# EAGLE board bfc (EAGLE 9.6.1), part 1 of 3
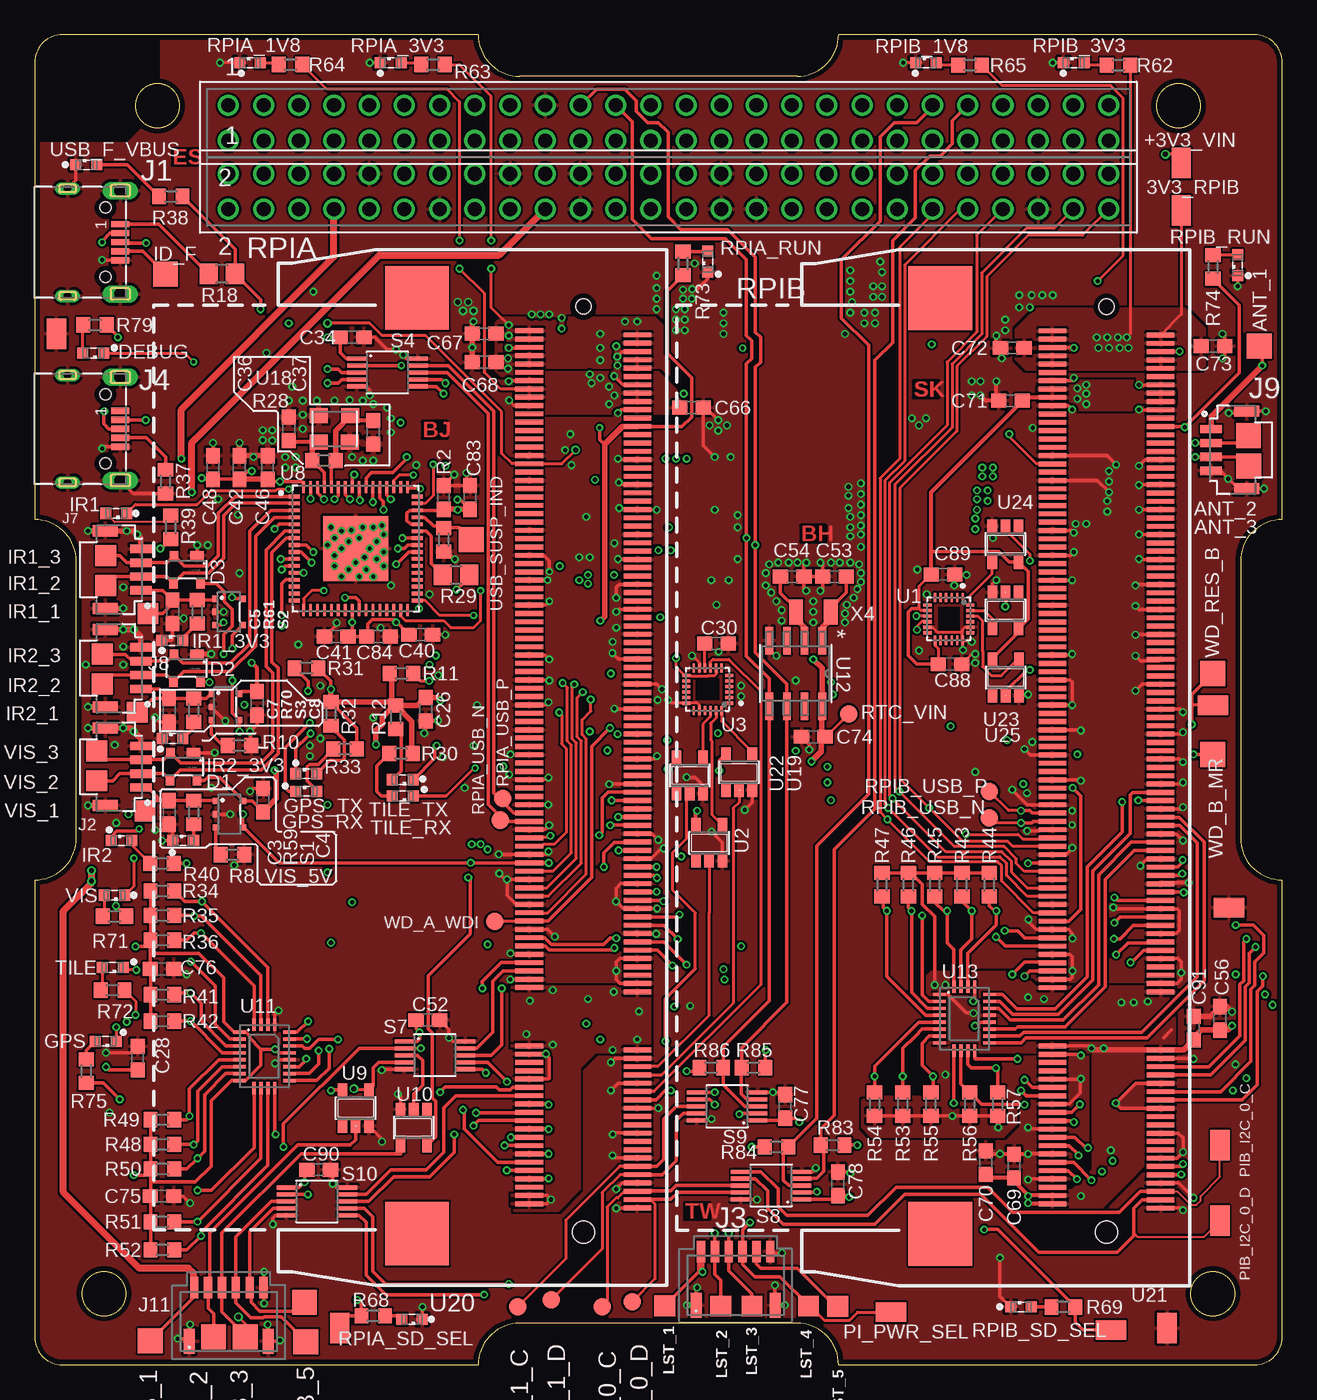
[diagram p8: board, top side]
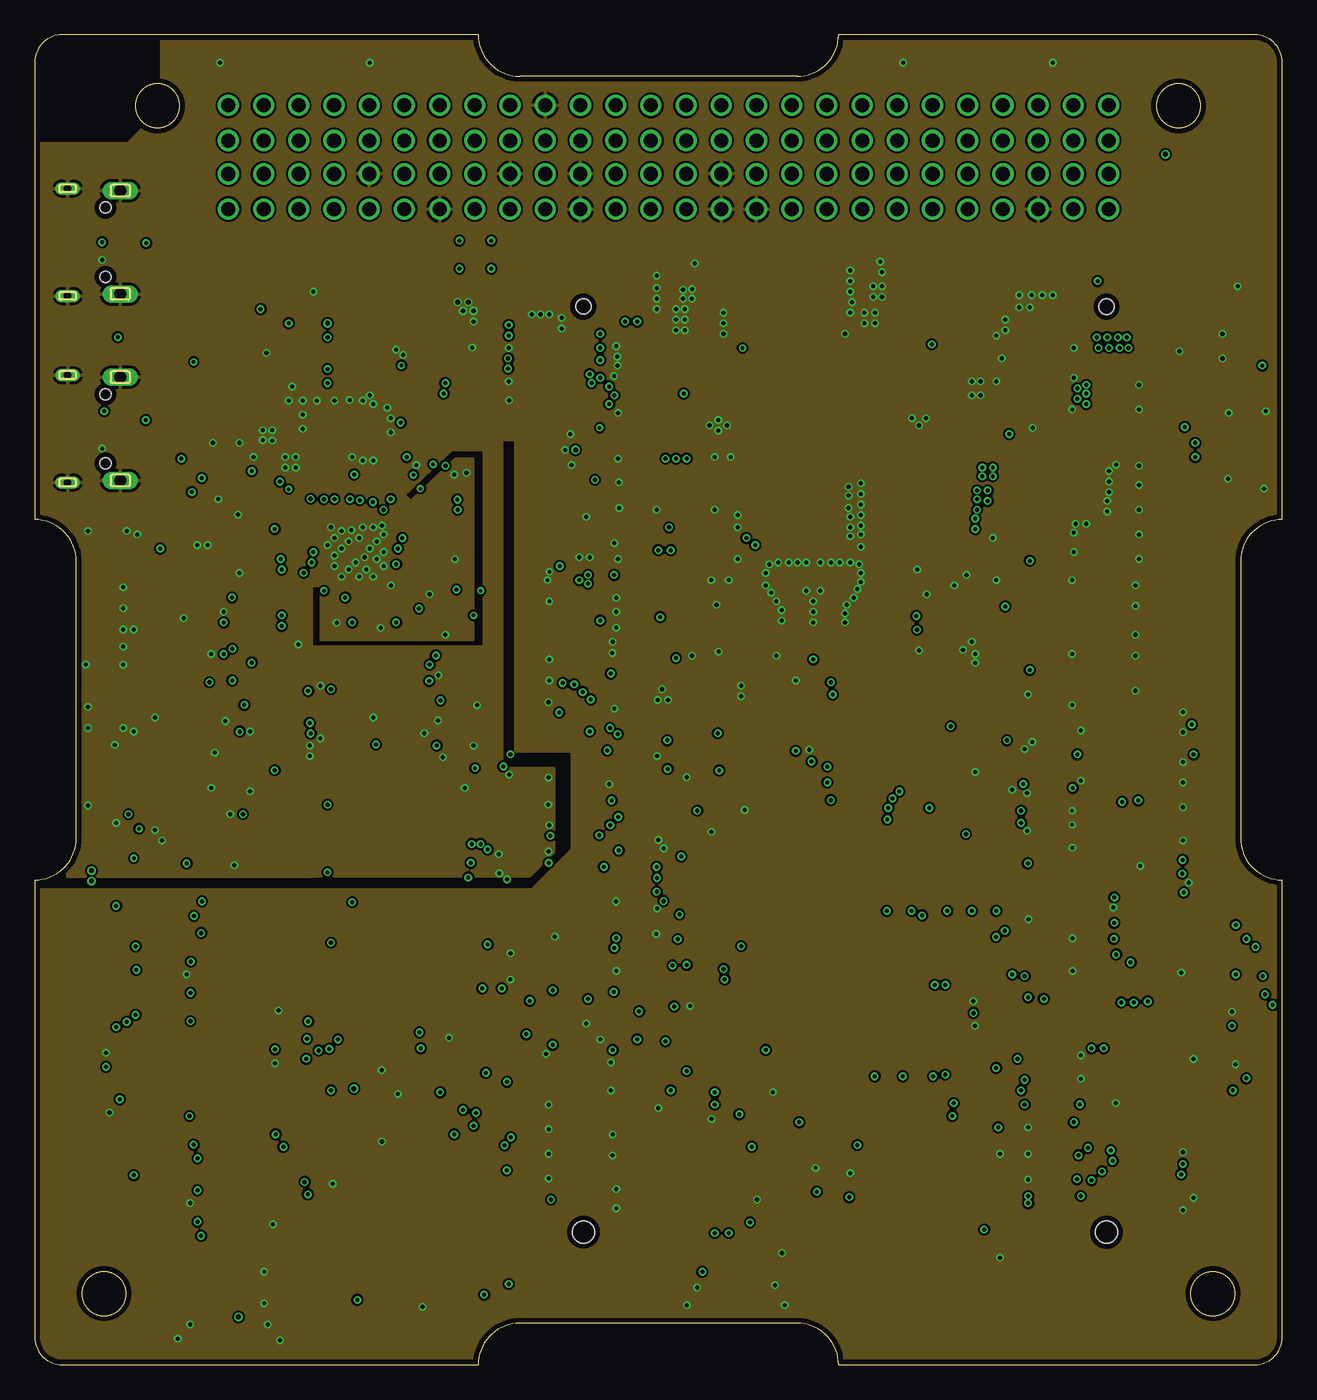
[diagram p9: board, inner layer Route2]
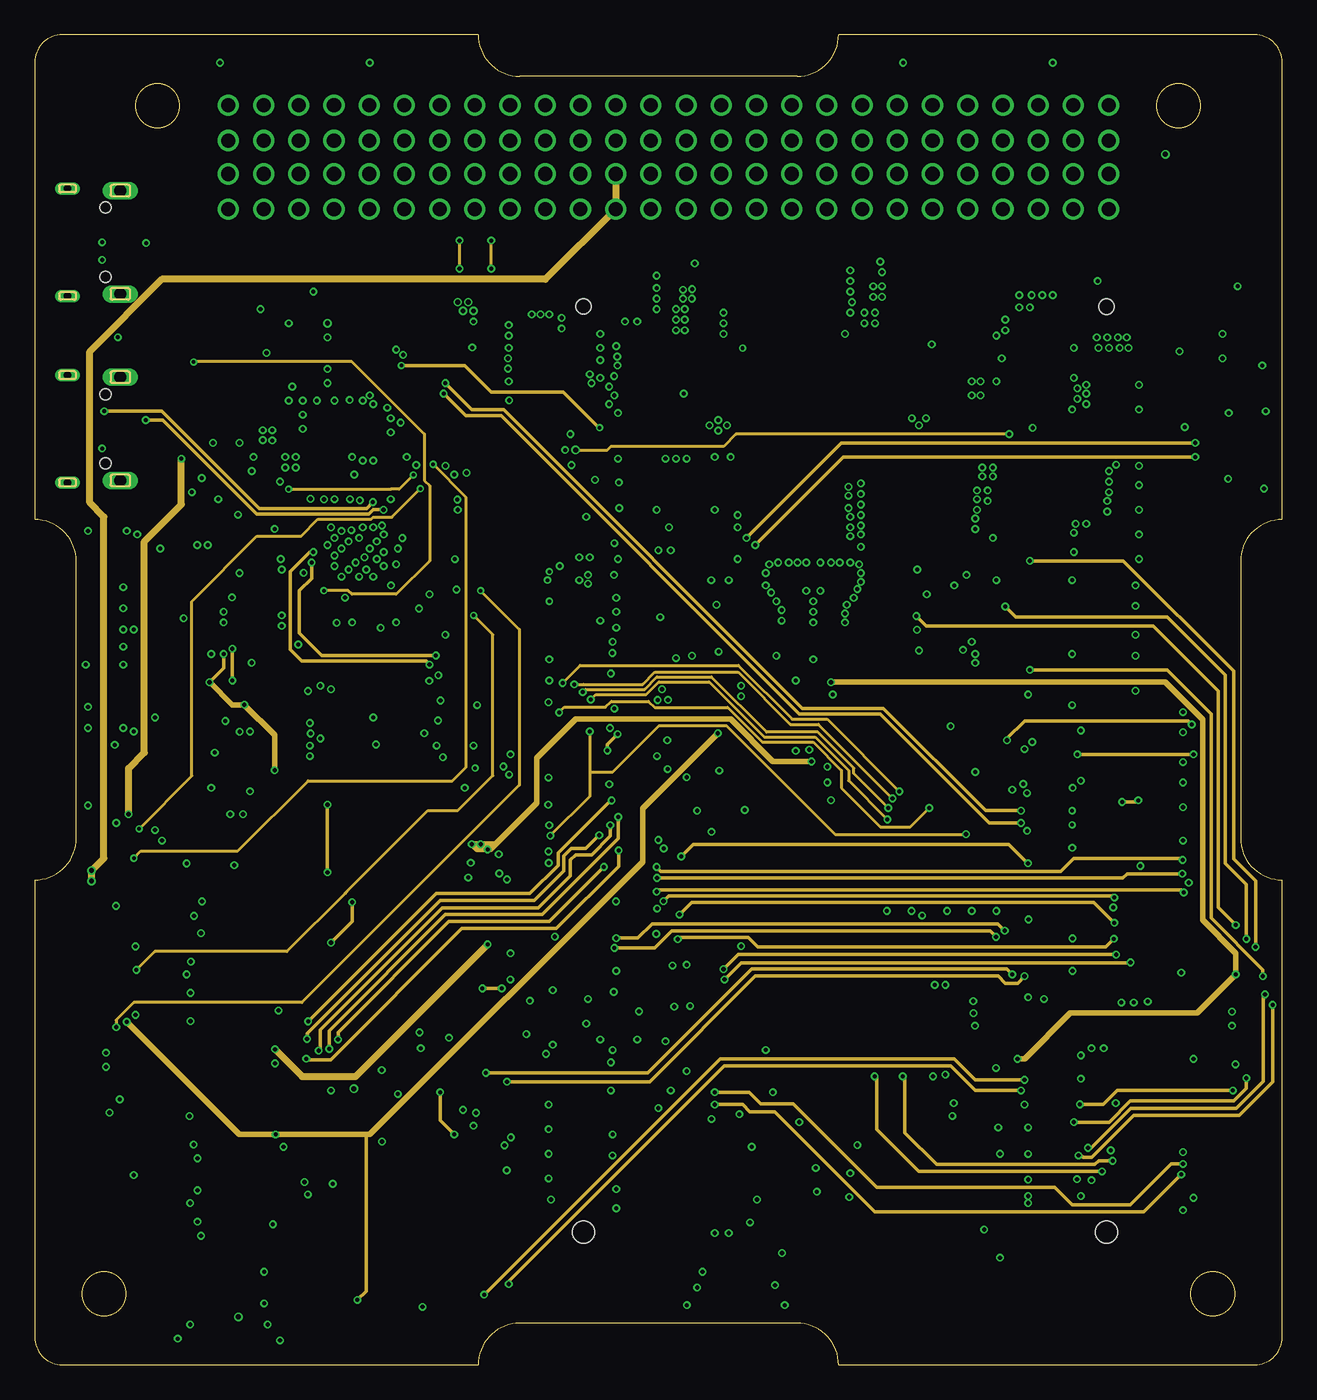
[diagram p10: board, inner layer Route3]
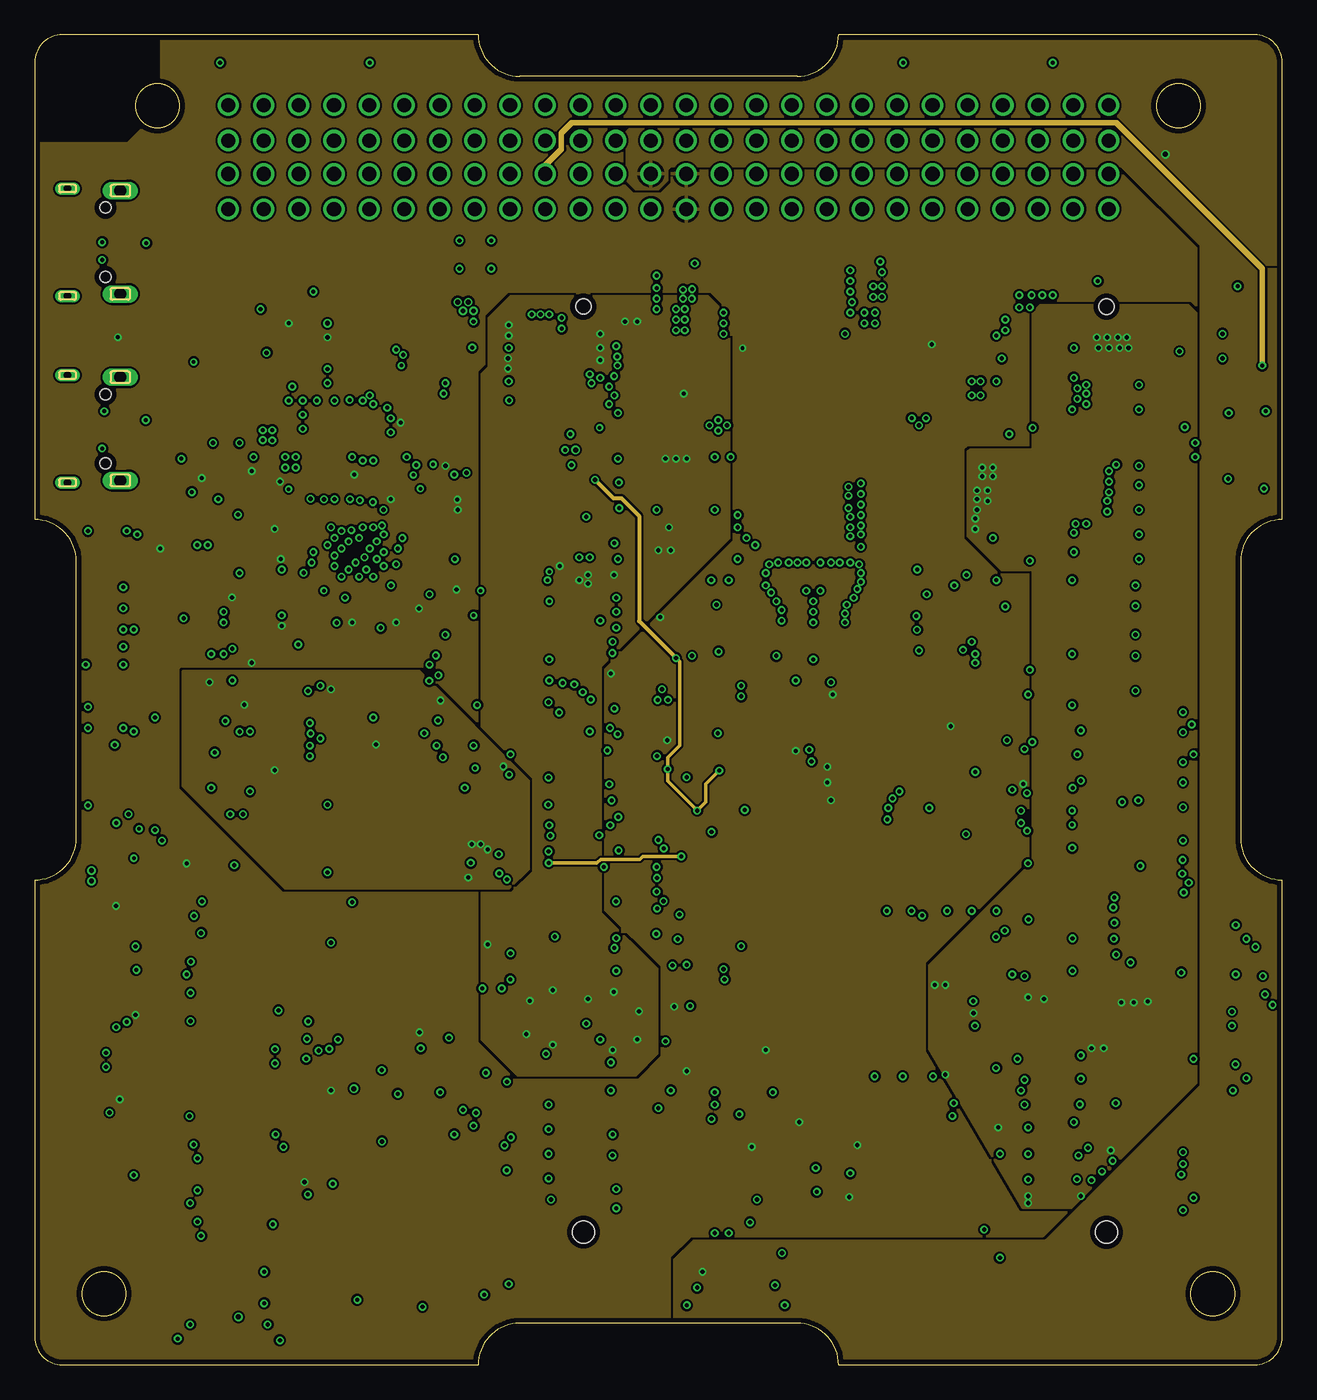
[diagram p11: board, inner layer Route14]
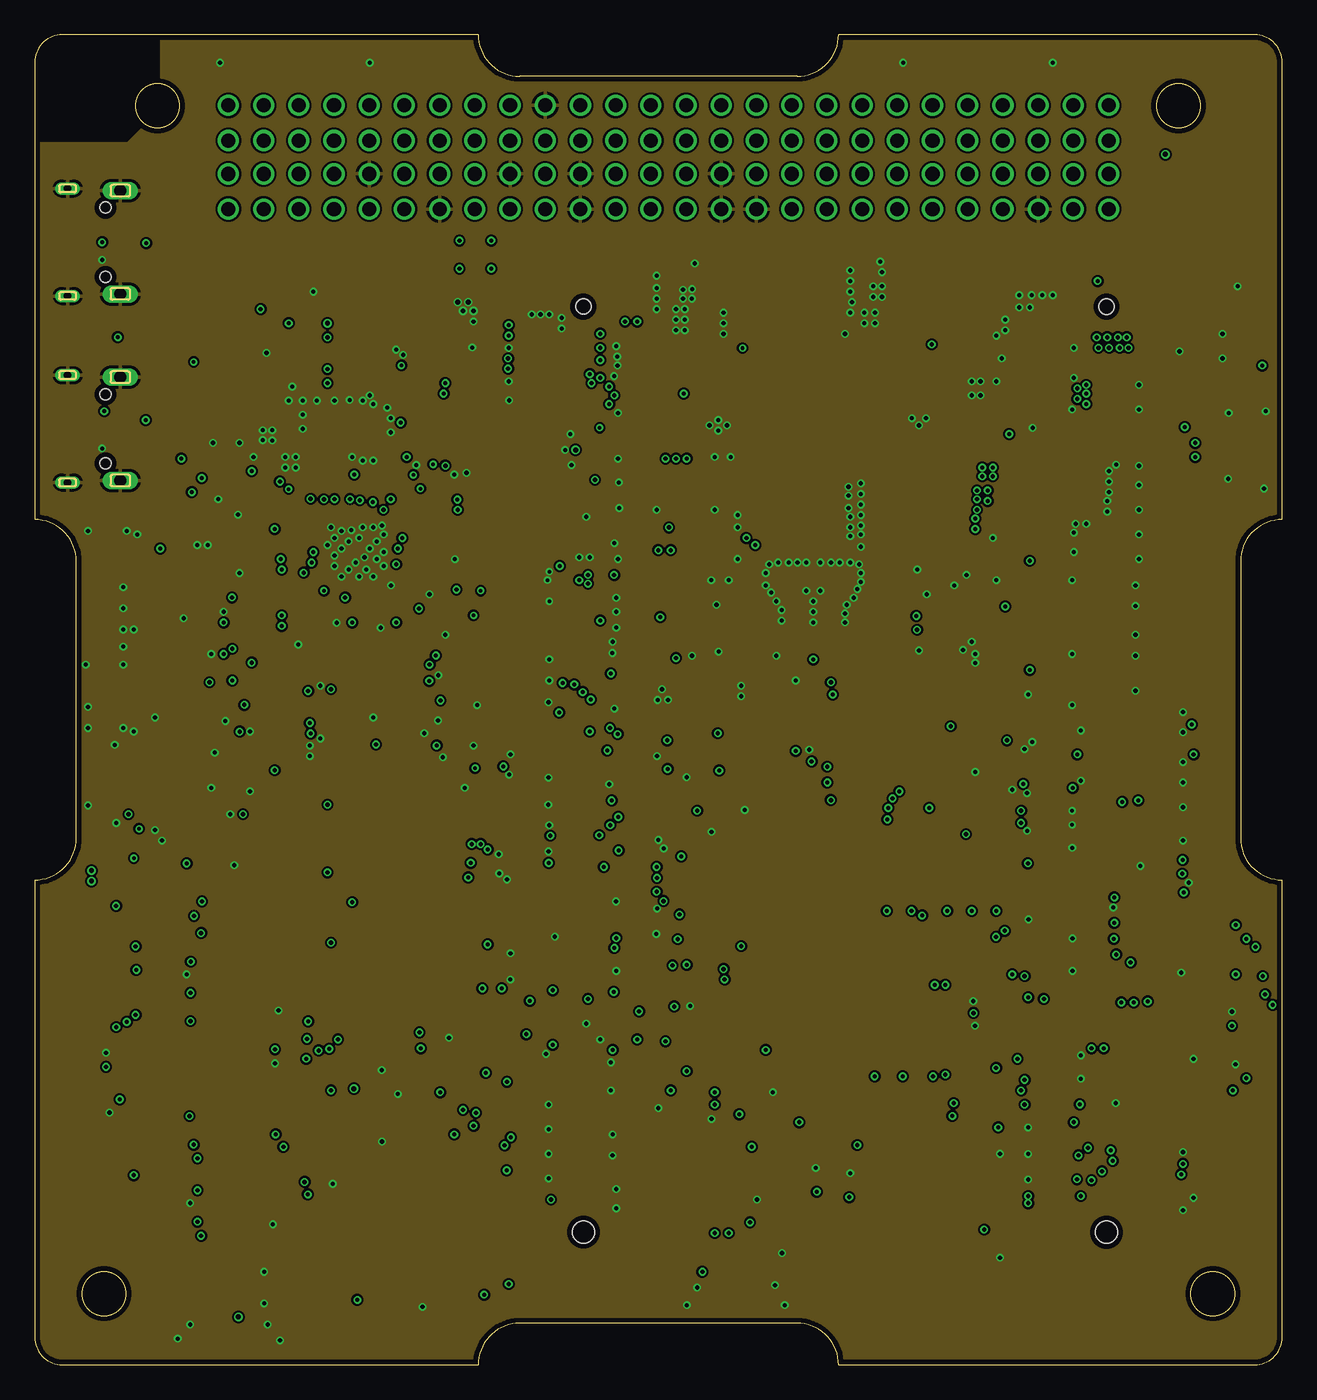
[diagram p12: board, inner layer Route15]
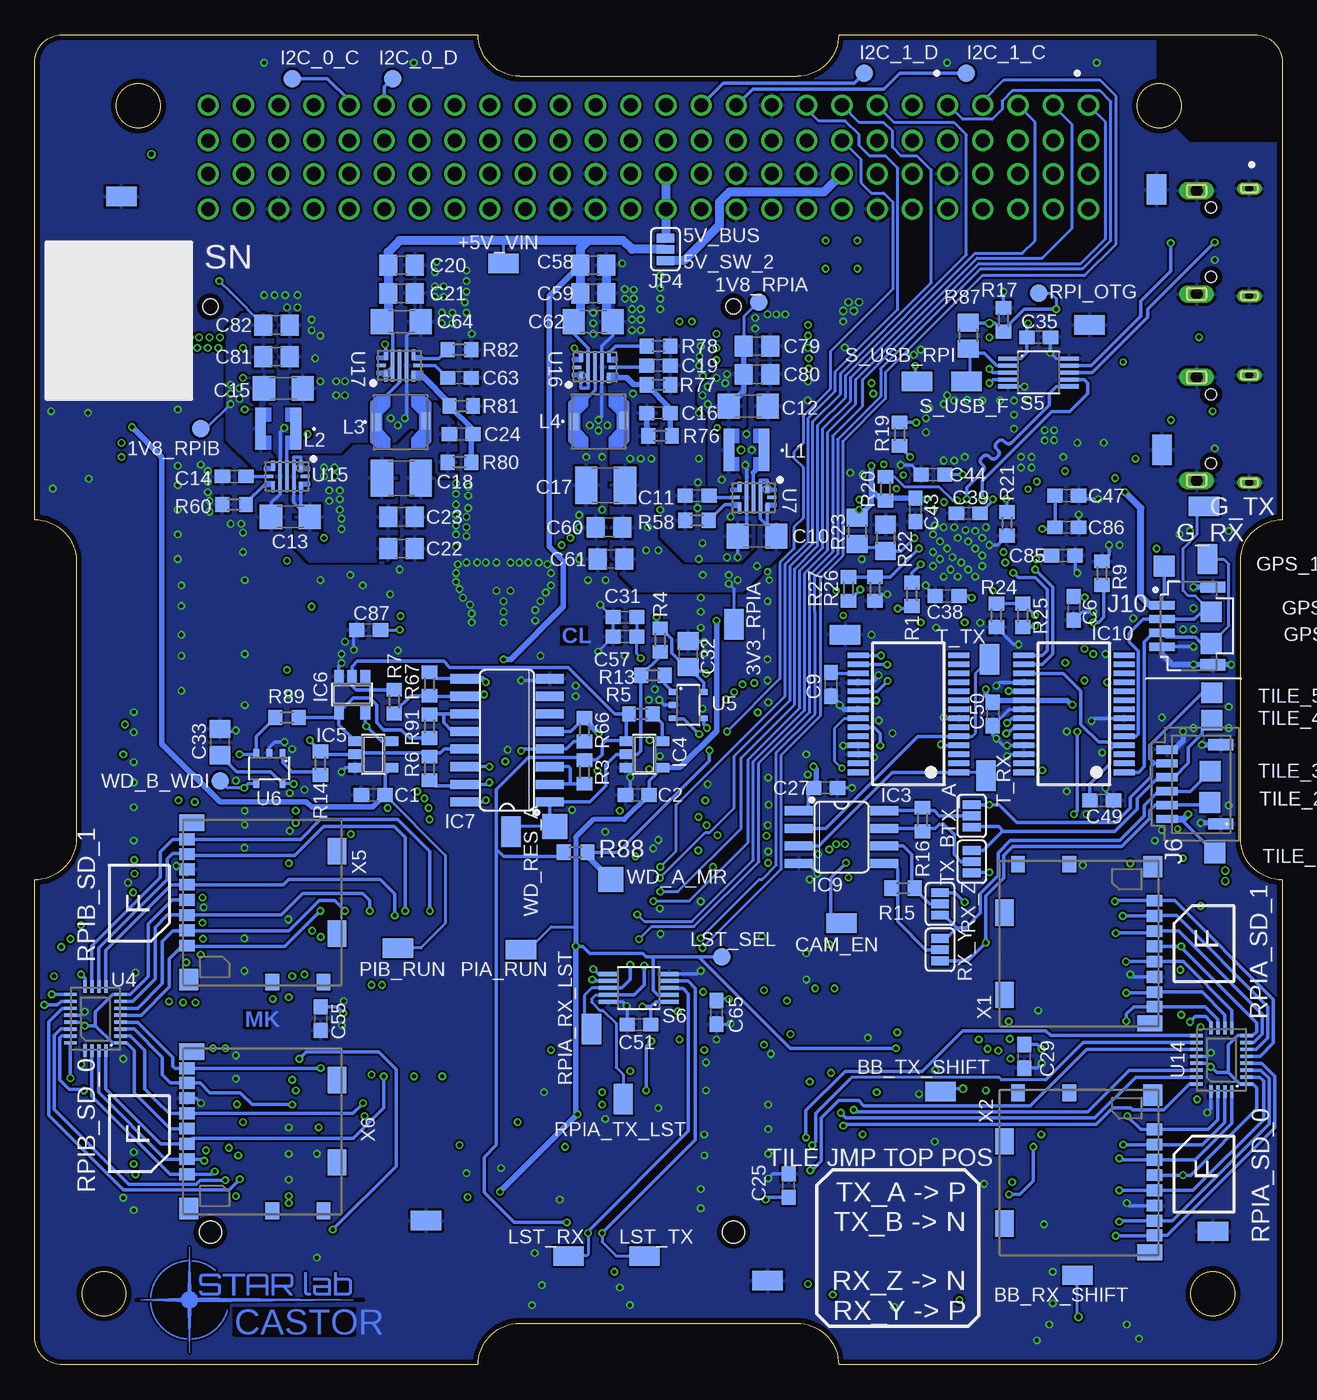
[diagram p13: board, bottom side, seen from below]

Size 90 x 96 mm. Coordinates in mm from the lower left corner, seen from the top.
Outline: 32,96 arc90 35,93 55,93 arc90 58,96 88,96 arc-90 90,94 90,61 arc90 87,58 87,38 arc90 90,35 90,2 arc-90 88,0 58,0 arc90 55,3 35,3 arc90 32,0 2,0 arc-90 0,2 0,35 arc90 3,38 3,58 arc90 0,61 0,94 arc-90 2,96 32,96
Outline: circle at 85,5.14 radius 1.59
Outline: circle at 8.86,90.86 radius 1.59
Outline: circle at 5,5.14 radius 1.59
Outline: circle at 82.52,90.86 radius 1.59
Copper layers (1+2*3+14*15+16): Top 0.035mm / dielectric 0.13mm / Route2 0.035mm / dielectric 0.15mm / Route3 0.035mm / dielectric 0.2mm / Route14 0.035mm / dielectric 0.15mm / Route15 0.035mm / dielectric 0.13mm / Bottom 0.035mm
Design rules "default *": minimum track width 6mil, minimum drill 10mil, track to track 6mil, track to pad 6mil, pad to pad 6mil, via to via 6mil, smd to smd 6mil, copper to edge 15mil, drill to drill 5mil, minimum pad ring 5mil, minimum via ring 5mil, stop-mask expansion 3mil, vias tented up to drill 12mil, thermal gap 8mil
tRestrict: 5 lines
bRestrict: 6 lines

## Footprints (pad centres in the part's own frame; a part is rotated, then mirrored left to right if it is on the bottom)
B1,27 = smd 1.27 x 1.27: TP 0,0
TP_HRWN = smd 1.4 x 2.2: P$1 0,0
TP18SQ = smd 1.8 x 1.8: TP 0,0
C0603 = smd 1.1 x 1: 1 -0.85,0; 2 0.85,0
C1206 = smd 1.6 x 1.8: 1 -1.4,0; 2 1.4,0
C1210 = smd 1.6 x 2.7: 1 -1.4,0; 2 1.4,0
C0805 = smd 1.3 x 1.5: 1 -0.95,0; 2 0.95,0
PRTR5V0U2X = smd 1 x 0.7: 1 -0.75,-1 | smd 0.6 x 0.7: 2 0.9,-1; 3 0.95,1; 4 -1,1
SML0603 = smd 0.8 x 0.8: A 0.75,0; C -0.75,0
TP15SQ = smd 1.5 x 1.5: TP 0,0
SSQ-126-XX-XXX-D = drill 1.016 pad 1.524: 1 -31.75,0; 2 -31.75,-2.54; 3 -29.21,0; 4 -29.21,-2.54; 5 -26.67,0; 6 -26.67,-2.54; 7 -24.13,0; 8 -24.13,-2.54; 9 -21.59,0; 10 -21.59,-2.54; 11 -19.05,0; 12 -19.05,-2.54; 13 -16.51,0; 14 -16.51,-2.54; 15 -13.97,0; 16 -13.97,-2.54; 17 -11.43,0; 18 -11.43,-2.54; 19 -8.89,0; 20 -8.89,-2.54; 21 -6.35,0; 22 -6.35,-2.54; 23 -3.81,0; 24 -3.81,-2.54; 25 -1.27,0; 26 -1.27,-2.54; 27 1.27,0; 28 1.27,-2.54; 29 3.81,0; 30 3.81,-2.54; 31 6.35,0; 32 6.35,-2.54; 33 8.89,0; 34 8.89,-2.54; 35 11.43,0; 36 11.43,-2.54; 37 13.97,0; 38 13.97,-2.54; 39 16.51,0; 40 16.51,-2.54; 41 19.05,0; 42 19.05,-2.54; 43 21.59,0; 44 21.59,-2.54; 45 24.13,0; 46 24.13,-2.54; 47 26.67,0; 48 26.67,-2.54; 49 29.21,0; 50 29.21,-2.54; 51 31.75,0; 52 31.75,-2.54
SSOP28 = smd 0.4 x 1.5: 1 -4.225,-3.625; 2 -3.575,-3.625; 3 -2.925,-3.625; 4 -2.275,-3.625; 5 -1.625,-3.625; 6 -0.975,-3.625; 7 -0.325,-3.625; 8 0.325,-3.625; 9 0.975,-3.625; 10 1.625,-3.625; 11 2.275,-3.625; 12 2.925,-3.625; 13 3.575,-3.625; 14 4.225,-3.625; 15 4.225,3.625; 16 3.575,3.625; 17 2.925,3.625; 18 2.275,3.625; 19 1.625,3.625; 20 0.975,3.625; 21 0.325,3.625; 22 -0.325,3.625; 23 -0.975,3.625; 24 -1.625,3.625; 25 -2.275,3.625; 26 -2.925,3.625; 27 -3.575,3.625; 28 -4.225,3.625
SOT23-5 = smd 0.69 x 0.99: 1 -0.95,-1.29; 2 0,-1.29; 3 0.95,-1.29; 4 0.95,1.3; 5 -0.95,1.3
SO16 = smd 0.66 x 2.032: 1 -4.445,-3.073; 2 -3.175,-3.073; 3 -1.905,-3.073; 4 -0.635,-3.073; 5 0.635,-3.073; 6 1.905,-3.073; 7 3.175,-3.073; 8 4.445,-3.073; 9 4.445,3.073; 10 3.175,3.073; 11 1.905,3.073; 12 0.635,3.073; 13 -0.635,3.073; 14 -1.905,3.073; 15 -3.175,3.073; 16 -4.445,3.073
SO08 = smd 0.66 x 2.032: 1 -1.905,-3.073; 2 -0.635,-3.073; 3 0.635,-3.073; 4 1.905,-3.073; 5 1.905,3.073; 6 0.635,3.073; 7 -0.635,3.073; 8 -1.905,3.073
629105150521 = smd 0.45 x 1.3: 1 -1.3,1.05; 2 -0.65,1.05; 3 0,1.05; 4 0.65,1.05; 5 1.3,1.05 | drill 0.85 pad 1.2 long: SHELL -3.725,1.05; SHELL1 3.725,1.05 | drill 0.55 pad 0.9 long: SHELL2 -3.875,-2.75; SHELL3 3.875,-2.75 | hole 0.8: -2.5,0; 2.5,0
SAMTEC_T1M-04-F-SV-L = smd 0.6 x 1.55: 1 -1.5,0; 2 -0.5,0; 3 0.5,0; 4 1.5,0 | smd 0.8 x 1.8: G1 -2.8,2.575; G2 2.8,2.575
T1M-06-F-SH-L-K = smd 0.6 x 1.55: 1 -2.5,4.953; 2 -1.5,4.953; 3 -0.5,4.953; 4 0.5,4.953; 5 1.5,4.953; 6 2.5,4.953 | smd 0.8 x 1.8: G1 -2.853,1.078; G2 2.853,1.078
SAMTEC_T1M-04-F-SH-L = smd 0.6 x 1.85: 1 -1.5,0; 2 -0.5,0; 3 0.5,0; 4 1.5,0 | smd 0.8 x 1.8: G1 -2.8,3.675; G2 2.8,3.675
SMT-JUMPER_3_1-NC_PASTE_SILK = smd 0.635 x 1.27: 1 -0.813,0; 2 0,0; 3 0.813,0
LPS3010 = smd 0.762 x 3.048: 1 -1.27,0; 2 1.27,0
INDP_LPS4018-472MRB = smd 0.635 x 1.27: 1 -1.77,0; 2 1.81,0.1
R0603 = smd 1 x 1.1: 1 -0.85,0; 2 0.85,0
R0805 = smd 1.3 x 1.5: 1 -0.95,0; 2 0.95,0
AAT4616 = smd 0.45 x 0.4: 1 0.95,1.012; 2 0,1.012; 3 -0.95,1.012; 4 -0.95,-1.012; 5 0.95,-1.012
FSUSB42MUX = smd 0.3 x 1.4: 1 -1,-2.2; 2 -0.5,-2.2; 3 0,-2.2; 4 0.5,-2.2; 5 1,-2.2; 6 1,2.2; 7 0.5,2.2; 8 0,2.2; 9 -0.5,2.2; 10 -1,2.2
QFN40P300X300X105-24N = smd 0.64 x 0.22: 1 -1.545,1; 2 -1.545,0.6; 3 -1.545,0.2; 4 -1.545,-0.2; 5 -1.545,-0.6; 6 -1.545,-1; 13 1.545,-1; 14 1.545,-0.6; 15 1.545,-0.2; 16 1.545,0.2; 17 1.545,0.6; 18 1.545,1 | smd 0.22 x 0.64: 7 -1,-1.545; 8 -0.6,-1.545; 9 -0.2,-1.545; 10 0.2,-1.545; 11 0.6,-1.545; 12 1,-1.545; 19 1,1.545; 20 0.6,1.545; 21 0.2,1.545; 22 -0.2,1.545; 23 -0.6,1.545; 24 -1,1.545
FSSD06-MLP = smd 0.9 x 0.24: 1 -2.3,0.25; 2 -2.3,0.75; 11 2.3,0.75; 12 2.3,0.25; 13 2.3,-0.25; 14 2.3,-0.75; 23 -2.3,-0.75; 24 -2.3,-0.25 | smd 0.24 x 0.9: 3 -1.75,1.8; 4 -1.25,1.8; 5 -0.75,1.8; 6 -0.25,1.8; 7 0.25,1.8; 8 0.75,1.8; 9 1.25,1.8; 10 1.75,1.8; 15 1.75,-1.8; 16 1.25,-1.8; 17 0.75,-1.8; 18 0.25,-1.8; 19 -0.25,-1.8; 20 -0.75,-1.8; 21 -1.25,-1.8; 22 -1.75,-1.8
AMD6316 = smd 0.425 x 0.6: 1 -0.95,-1.1; 2 0,-1.1; 3 0.95,-1.1; 4 0.95,1.1; 5 -0.95,1.1
RWY0009A = smd 0.775 x 0.25: 1 -0.761,1; 5 -0.761,-1; 7 0.761,-1; 8 0.761,1 | smd 2.3 x 0.25: 2 0,0.5; 3 0,0; 4 0,-0.5 | smd 0.25 x 0.65: 6 0,-1.325; 9 0,1.325
QFN50P900X900X100-65N = smd 0.86 x 0.26: 1 -4.435,3.75; 2 -4.435,3.25; 3 -4.435,2.75; 4 -4.435,2.25; 5 -4.435,1.75; 6 -4.435,1.25; 7 -4.435,0.75; 8 -4.435,0.25; 9 -4.435,-0.25; 10 -4.435,-0.75; 11 -4.435,-1.25; 12 -4.435,-1.75; 13 -4.435,-2.25; 14 -4.435,-2.75; 15 -4.435,-3.25; 16 -4.435,-3.75; 33 4.435,-3.75; 34 4.435,-3.25; 35 4.435,-2.75; 36 4.435,-2.25; 37 4.435,-1.75; 38 4.435,-1.25; 39 4.435,-0.75; 40 4.435,-0.25; 41 4.435,0.25; 42 4.435,0.75; 43 4.435,1.25; 44 4.435,1.75; 45 4.435,2.25; 46 4.435,2.75; 47 4.435,3.25; 48 4.435,3.75 | smd 0.26 x 0.86: 17 -3.75,-4.435; 18 -3.25,-4.435; 19 -2.75,-4.435; 20 -2.25,-4.435; 21 -1.75,-4.435; 22 -1.25,-4.435; 23 -0.75,-4.435; 24 -0.25,-4.435; 25 0.25,-4.435; 26 0.75,-4.435; 27 1.25,-4.435; 28 1.75,-4.435; 29 2.25,-4.435; 30 2.75,-4.435; 31 3.25,-4.435; 32 3.75,-4.435; 49 3.75,4.435; 50 3.25,4.435; 51 2.75,4.435; 52 2.25,4.435; 53 1.75,4.435; 54 1.25,4.435; 55 0.75,4.435; 56 0.25,4.435; 57 -0.25,4.435; 58 -0.75,4.435; 59 -1.25,4.435; 60 -1.75,4.435; 61 -2.25,4.435; 62 -2.75,4.435; 63 -3.25,4.435; 64 -3.75,4.435 | smd 4.7 x 4.7: 65 0,0
SOIC8-N_MC = smd 1.981 x 0.559: 1 -2.362,1.905; 2 -2.362,0.635; 3 -2.362,-0.635; 4 -2.362,-1.905; 5 2.362,-1.905; 6 2.362,-0.635; 7 2.362,0.635; 8 2.362,1.905
RH100 = smd 1.3 x 1.1: GND1 -1.15,0.95; GND2 1.1,-0.95; IN -1.15,-0.95; OUT 1.15,0.95
SO-DIMM = smd 0.35 x 2: 1 -26.4,-3.9; 2 -26.1,3.9; 3 -25.8,-3.9; 4 -25.5,3.9; 5 -25.2,-3.9; 6 -24.9,3.9; 7 -24.6,-3.9; 8 -24.3,3.9; 9 -24,-3.9; 10 -23.7,3.9; 11 -23.4,-3.9; 12 -23.1,3.9; 13 -22.8,-3.9; 14 -22.5,3.9; 15 -22.2,-3.9; 16 -21.9,3.9; 17 -21.6,-3.9; 18 -21.3,3.9; 19 -21,-3.9; 20 -20.7,3.9; 21 -20.4,-3.9; 22 -20.1,3.9; 23 -19.8,-3.9; 24 -19.5,3.9; 25 -19.2,-3.9; 26 -18.9,3.9; 27 -18.6,-3.9; 28 -18.3,3.9; 29 -18,-3.9; 30 -17.7,3.9; 31 -17.4,-3.9; 32 -17.1,3.9; 33 -16.8,-3.9; 34 -16.5,3.9; 35 -16.2,-3.9; 36 -15.9,3.9; 37 -15.6,-3.9; 38 -15.3,3.9; 39 -15,-3.9; 40 -14.7,3.9; 41 -10.8,-3.9; 42 -10.5,3.9; 43 -10.2,-3.9; 44 -9.9,3.9; 45 -9.6,-3.9; 46 -9.3,3.9; 47 -9,-3.9; 48 -8.7,3.9; 49 -8.4,-3.9; 50 -8.1,3.9; 51 -7.8,-3.9; 52 -7.5,3.9; 53 -7.2,-3.9; 54 -6.9,3.9; 55 -6.6,-3.9; 56 -6.3,3.9; 57 -6,-3.9; 58 -5.7,3.9; 59 -5.4,-3.9; 60 -5.1,3.9; 61 -4.8,-3.9; 62 -4.5,3.9; 63 -4.2,-3.9; 64 -3.9,3.9; 65 -3.6,-3.9; 66 -3.3,3.9; 67 -3,-3.9; 68 -2.7,3.9; 69 -2.4,-3.9; 70 -2.1,3.9; 71 -1.8,-3.9; 72 -1.5,3.9; 73 -1.2,-3.9; 74 -0.9,3.9; 75 -0.6,-3.9; 76 -0.3,3.9; 77 0,-3.9; 78 0.3,3.9; 79 0.6,-3.9; 80 0.9,3.9; 81 1.2,-3.9; 82 1.5,3.9; 83 1.8,-3.9; 84 2.1,3.9; 85 2.4,-3.9; 86 2.7,3.9; 87 3,-3.9; 88 3.3,3.9; 89 3.6,-3.9; 90 3.9,3.9; 91 4.2,-3.9; 92 4.5,3.9; 93 4.8,-3.9; 94 5.1,3.9; 95 5.4,-3.9; 96 5.7,3.9; 97 6,-3.9; 98 6.3,3.9; 99 6.6,-3.9; 100 6.9,3.9; 101 7.2,-3.9; 102 7.5,3.9; 103 7.8,-3.9; 104 8.1,3.9; 105 8.4,-3.9; 106 8.7,3.9; 107 9,-3.9; 108 9.3,3.9; 109 9.6,-3.9; 110 9.9,3.9; 111 10.2,-3.9; 112 10.5,3.9; 113 10.8,-3.9; 114 11.1,3.9; 115 11.4,-3.9; 116 11.7,3.9; 117 12,-3.9; 118 12.3,3.9; 119 12.6,-3.9; 120 12.9,3.9; 121 13.2,-3.9; 122 13.5,3.9; 123 13.8,-3.9; 124 14.1,3.9; 125 14.4,-3.9; 126 14.7,3.9; 127 15,-3.9; 128 15.3,3.9; 129 15.6,-3.9; 130 15.9,3.9; 131 16.2,-3.9; 132 16.5,3.9; 133 16.8,-3.9; 134 17.1,3.9; 135 17.4,-3.9; 136 17.7,3.9; 137 18,-3.9; 138 18.3,3.9; 139 18.6,-3.9; 140 18.9,3.9; 141 19.2,-3.9; 142 19.5,3.9; 143 19.8,-3.9; 144 20.1,3.9; 145 20.4,-3.9; 146 20.7,3.9; 147 21,-3.9; 148 21.3,3.9; 149 21.6,-3.9; 150 21.9,3.9; 151 22.2,-3.9; 152 22.5,3.9; 153 22.8,-3.9; 154 23.1,3.9; 155 23.4,-3.9; 156 23.7,3.9; 157 24,-3.9; 158 24.3,3.9; 159 24.6,-3.9; 160 24.9,3.9; 161 25.2,-3.9; 162 25.5,3.9; 163 25.8,-3.9; 164 26.1,3.9; 165 26.4,-3.9; 166 26.7,3.9; 167 27,-3.9; 168 27.3,3.9; 169 27.6,-3.9; 170 27.9,3.9; 171 28.2,-3.9; 172 28.5,3.9; 173 28.8,-3.9; 174 29.1,3.9; 175 29.4,-3.9; 176 29.7,3.9; 177 30,-3.9; 178 30.3,3.9; 179 30.6,-3.9; 180 30.9,3.9; 181 31.2,-3.9; 182 31.5,3.9; 183 31.8,-3.9; 184 32.1,3.9; 185 32.4,-3.9; 186 32.7,3.9; 187 33,-3.9; 188 33.3,3.9; 189 33.6,-3.9; 190 33.9,3.9; 191 34.2,-3.9; 192 34.5,3.9; 193 34.8,-3.9; 194 35.1,3.9; 195 35.4,-3.9; 196 35.7,3.9; 197 36,-3.9; 198 36.3,3.9; 199 36.6,-3.9; 200 36.9,3.9 | smd 4.6 x 4.6: G1 -28.254,12; G2 39.27,12 | hole 1.6: -28.15,0 | hole 1.1: 38.65,0
1040310811 = smd 0.85 x 1.1: 1 3.105,0.25; 2 2.005,0.25; 3 0.905,0.25; 4 -0.195,0.25; 5 -1.295,0.25; 6 -2.395,0.25; 7 -3.495,0.25; 8 -4.545,0.25 | smd 1.2 x 1: 11 5.74,6.4; 12 5.74,10.1 | smd 1.55 x 1.35: G1 5.565,0.375 | smd 1.17 x 1.8: G2 -5.755,0.6 | smd 1.9 x 1.35: G3 -3.7,11.075; G4 2.24,11.075
TC-135 = smd 1 x 1.8: 1 -1.25,0; 2 1.25,0

## Placement (x,y rotation side)
1V8_RPIA  TPB1,27  [B1,27]  37.76,76.7 0 bottom
1V8_RPIB  TPB1,27  [B1,27]  78.02,67.55 0 bottom
3V3_RPIA  TP_HRWN  [TP_HRWN]  39.54,53.45 0 bottom
3V3_RPIB  TP_HRWN  [TP_HRWN]  82.72,83.3 180 top
+3V3_VIN  TP_HRWN  [TP_HRWN]  82.72,86.73 180 top
+5V_VIN  TP_HRWN  [TP_HRWN]  56.18,79.49 270 bottom
ANT_1  TPTP18SQ  [TP18SQ]  88.36,73.52 0 top
ANT_2  TPTP18SQ  [TP18SQ]  87.57,67.07 0 top
ANT_3  TPTP18SQ  [TP18SQ]  87.6,64.86 0 top
BB_1  TPTP18SQ  [TP18SQ]  8.33,1.73 90 top
BB_2  TPTP18SQ  [TP18SQ]  12.9,2.01 90 top
BB_3  TPTP18SQ  [TP18SQ]  15.19,2.01 90 top
BB_4  TPTP18SQ  [TP18SQ]  19.57,1.68 90 top
BB_5  TPTP18SQ  [TP18SQ]  19.47,4.53 90 top
BB_RX_SHIFT  TP_HRWN  [TP_HRWN]  14.77,6.47 270 bottom
BB_TX_SHIFT  TP_HRWN  [TP_HRWN]  24.65,19.72 270 bottom
C1  DNP  [C0603]  65.57,41.14 180 bottom
C2  DNP  [C0603]  46.52,41.14 180 bottom
C3  1u 16V  [C0603]  9.69,39.87 270 top
C4  0.47u 16V  [C0603]  16.48,40.76 90 top
C5  1u 16V  [C0603]  9.95,54.34 270 top
C6  0.47u 16V  [C0603]  15.03,54.6 270 bottom
C7  1u 16V  [C0603]  9.69,47.23 270 top
C8  0.47u 16V  [C0603]  16.04,47.74 270 top
C9  0.1u 10V  [C0603]  32.55,49.11 270 bottom
C10  22u 16V  [C1206]  37.89,59.8 180 bottom
C11  4.7n 16V  [C0603]  42.21,62.73 180 bottom
C12  10u 10V  [C1206]  38.52,69.2 0 bottom
C13  22u 16V  [C1206]  71.54,61.2 180 bottom
C14  4.7n 16V  [C0603]  75.61,64.12 180 bottom
C15  10u 10V  [C1206]  72.05,70.47 0 bottom
C16  10p 50V  [C0603]  45,68.69 0 bottom
C17  47u 16V  [C1210]  48.81,63.49 180 bottom
C18  47u 16V  [C1210]  63.54,64 0 bottom
C19  4.7n 16V  [C0603]  45,72.12 0 bottom
C20  DNP  [C0805]  63.54,79.36 0 bottom
C21  DNP  [C0805]  63.54,77.33 0 bottom
C22  DNP  [C0805]  63.54,58.92 0 bottom
C23  DNP  [C0805]  63.54,61.2 0 bottom
C24  10p 50V  [C0603]  59.22,67.17 0 bottom
C25  0.1u 10V  [C0603]  35.6,12.94 90 bottom
C26  1u 16V  [C0603]  28.2,47.32 270 top
C27  1u 16V  [C0603]  32.94,41.64 0 bottom
C28  0.1u 10V  [C0603]  7.43,22.14 90 top
C29  0.1u 10V  [C0603]  18.61,22.27 270 bottom
C30  0.1u 10V  [C0603]  49.19,52.06 0 top
C31  0.1u 10V  [C0603]  47.41,53.96 180 bottom
C32  10u 10V  [C0805]  42.84,51.3 90 bottom
C33  10u 10V  [C0805]  76.62,44.95 90 bottom
C34  0.1u 10V  [C0603]  22.9,74.16 0 top
C35  0.1u 10V  [C0603]  17.57,74.16 0 bottom
C36  33pF 10V  [C0603]  18.33,67.55 90 top
C37  33pF 10V  [C0603]  24.43,67.3 90 top
C38  1u 16V  [C0603]  24.17,55.49 180 bottom
C39  1u 16V  [C0603]  22.65,61.46 180 bottom
C40  1u 16V  [C0603]  27.86,52.69 0 top
C41  0.1u 10V  [C0603]  21.76,52.57 180 top
C42  0.1u 10V  [C0603]  14.77,64.76 90 top
C43  0.1u 10V  [C0603]  26.46,61.71 270 bottom
C44  0.1u 10V  [C0603]  25.19,64.25 180 bottom
C45  0.1u 10V  [C0603]  29.51,62.6 90 top
C46  1u 16V  [C0603]  16.81,64.76 90 top
C47  DNP  [C0603]  15.54,62.73 0 bottom
C48  DNP  [C0603]  12.87,64.76 90 top
C49  0.1u 10V  [C0603]  13.02,40.73 0 bottom
C50  1u 16V  [C0603]  20.87,46.98 270 bottom
C51  0.1u 10V  [C0603]  46.4,24.55 180 bottom
C52  0.1u 10V  [C0603]  28.36,24.88 0 top
C53  6.8p 16V  [C0603]  57.7,56.88 180 top
C54  6.8p 16V  [C0603]  54.65,56.88 180 top
C55  0.1u 10V  [C0603]  69.36,24.98 270 bottom
C56  0.1u 10V  [C0603]  85.51,25.01 90 top
C57  0.1u 10V  [C0603]  47.41,52.57 180 bottom
C58  DNP  [C0805]  49.7,79.36 0 bottom
C59  DNP  [C0805]  49.7,77.33 0 bottom
C60  DNP  [C0805]  48.56,60.44 180 bottom
C61  DNP  [C0805]  48.43,58.15 180 bottom
C62  22u 16V  [C1206]  49.7,75.3 0 bottom
C63  4.7n 16V  [C0603]  59.35,71.23 0 bottom
C64  22u 16V  [C1206]  63.54,75.3 0 bottom
C65  0.1u 10V  [C0603]  40.81,25.44 270 bottom
C66  0.1u 10V  [C0603]  47.39,69.08 0 top
C67  0.1u 10V  [C0603]  32.43,74.41 180 top
C68  1u 16V  [C0603]  32.43,72.38 180 top
C69  0.1u 10V  [C0603]  70.65,14.34 90 top
C70  1u 16V  [C0603]  68.62,14.59 90 top
C71  0.1u 10V  [C0603]  70.4,69.58 180 top
C72  0.1u 10V  [C0603]  70.53,73.39 180 top
C73  0.1u 10V  [C0603]  85,73.52 0 top
C74  0.1u 10V  [C0603]  56.18,45.33 180 top
C75  0.1u 10V  [C0603]  9.19,12.18 0 top
C76  0.1u 10V  [C0603]  9.19,28.56 0 top
C77  0.1u 10V  [C0603]  54.14,18.66 90 top
C78  0.1u 10V  [C0603]  57.95,13.07 90 top
C79  DNP  [C0805]  37.89,73.52 0 bottom
C80  DNP  [C0805]  37.89,71.49 0 bottom
C81  DNP  [C0805]  72.56,72.76 0 bottom
C82  DNP  [C0805]  72.56,75.05 0 bottom
C83  DNP  [C0603]  31.41,62.6 90 top
C84  10n 10V  [C0603]  24.81,52.57 0 top
C85  0.1u 10V  [C0603]  15.79,58.41 0 bottom
C86  0.1u 10V  [C0603]  15.54,60.44 0 bottom
C87  0.1u 10V  [C0603]  65.91,53.04 180 bottom
C88  0.1u 10V  [C0603]  66.03,50.57 0 top
C89  0.1u 10V  [C0603]  65.53,57.04 0 top
C90  0.1u 10V  [C0603]  20.49,14.08 0 top
C91  0.1u 10V  [C0603]  83.61,24.3 90 top
CAM_EN  TP_HRWN  [TP_HRWN]  31.79,31.86 270 bottom
D1  PRTR5V0U2X  [PRTR5V0U2X]  10.71,43.17 180 top
D2  PRTR5V0U2X  [PRTR5V0U2X]  10.96,50.28 180 top
D3  PRTR5V0U2X  [PRTR5V0U2X]  10.96,57.39 180 top
DEBUG  green  [SML0603]  4.23,73.01 180 top
G_RX  TP_HRWN  [TP_HRWN]  5.38,58.15 0 bottom
G_TX  TP_HRWN  [TP_HRWN]  5.63,61.96 270 bottom
GND  TP_HRWN  [TP_HRWN]  31.54,52.69 270 bottom
GND49  TP_HRWN  [TP_HRWN]  13.89,75.05 90 bottom
GND51  TP_HRWN  [TP_HRWN]  8.68,66.03 0 bottom
GND53  TP_HRWN  [TP_HRWN]  1.57,74.41 180 top
GND55  TP_HRWN  [TP_HRWN]  4.99,9.64 270 bottom
GND58  TP_HRWN  [TP_HRWN]  61.76,10.4 270 bottom
GND59  TP_HRWN  [TP_HRWN]  37.13,6.08 270 bottom
GND62  TP_HRWN  [TP_HRWN]  86.15,33.01 90 top
GND64  TP_HRWN  [TP_HRWN]  9.06,84.82 180 bottom
GND66  TP_HRWN  [TP_HRWN]  83.73,84.32 270 bottom
GND70  TP_HRWN  [TP_HRWN]  81.7,2.66 180 top
GPS  green  [SML0603]  5.12,23.36 180 top
GPS_1  TPTP15SQ  [TP15SQ]  8.5,57.65 0 bottom
GPS_2  TPTP15SQ  [TP15SQ]  5.12,54.34 0 bottom
GPS_3  TPTP15SQ  [TP15SQ]  5.12,52.06 0 bottom
GPS_RX  Green  [SML0603]  19.6,41.39 0 top
GPS_TX  Red  [SML0603]  19.6,42.66 0 top
H1-CONNECTOR1  SSQ-126-XX-XXX-D  [SSQ-126-XX-XXX-D]  45.73,90.9 0 top
H2-CONNECTOR1  SSQ-126-XX-XXX-D  [SSQ-126-XX-XXX-D]  45.73,85.95 0 top
I2C_0_C  TPB1,27  [B1,27]  71.42,92.83 0 bottom
I2C_0_D  TPB1,27  [B1,27]  64.18,92.83 0 bottom
I2C_1_C  TPB1,27  [B1,27]  22.77,93.21 0 bottom
I2C_1_D  TPB1,27  [B1,27]  30.14,93.21 0 bottom
IC3  FT232RL  [SSOP28]  26.97,46.98 90 bottom
IC4  74AUC1G08DBV  [SOT23-5]  46.02,44.06 270 bottom
IC5  74AUC1G08DBV  [SOT23-5]  65.57,44.06 270 bottom
IC6  74AHCT1G14DBV  [SOT23-5]  67.1,48.38 180 bottom
IC7  74LS112D  [SO16]  55.92,45.07 90 bottom
IC9  MAX488CSA  [SO08]  31.79,38.09 270 bottom
IC10  FT232RL  [SSOP28]  15.03,46.98 90 bottom
ID_F  TPTP18SQ  [TP18SQ]  9.44,78.73 0 top
IR1  green  [SML0603]  5.88,61.46 180 top
IR1_1  TPTP15SQ  [TP15SQ]  8.17,54.22 0 top
IR1_2  TPTP15SQ  [TP15SQ]  5.12,56.25 0 top
IR1_3  TPTP15SQ  [TP15SQ]  5.12,58.41 0 top
IR1_3V3  red  [SML0603]  9.92,52.26 0 top
IR2  green  [SML0603]  6.27,37.83 0 top
IR2_1  TPTP15SQ  [TP15SQ]  7.41,47.1 0 top
IR2_2  TPTP15SQ  [TP15SQ]  4.87,49.14 0 top
IR2_3  TPTP15SQ  [TP15SQ]  4.87,51.3 0 top
IR2_3V3  red  [SML0603]  9.95,45.2 0 top
J1  [629105150521]  5.12,81.01 270 top
J2  T1M-04-F-SV-L  [SAMTEC_T1M-04-F-SV-L]  7.66,43.17 90 top
J3  T1M-06-F-SH-L-K  [T1M-06-F-SH-L-K]  50.57,3.23 0 top
J4  [629105150521]  5.12,67.55 270 top
J6  T1M-06-F-SH-L-K  [T1M-06-F-SH-L-K]  3.34,41.9 90 bottom
J7  T1M-04-F-SV-L  [SAMTEC_T1M-04-F-SV-L]  7.66,57.39 90 top
J8  T1M-04-F-SV-L  [SAMTEC_T1M-04-F-SV-L]  7.66,50.28 90 top
J9  T1M-04-F-SV-L  [SAMTEC_T1M-04-F-SV-L]  84.88,66.03 270 top
J10  T1M-04-F-SH-L  [SAMTEC_T1M-04-F-SH-L]  8.68,53.33 270 bottom
J11  T1M-06-F-SH-L-K  [T1M-06-F-SH-L-K]  14.01,0.62 0 top
JP4  JUMPER-SMT_3_1-NC_PASTE_SILK  [SMT-JUMPER_3_1-NC_PASTE_SILK]  44.49,80.51 90 bottom
L1  0.47uH  [LPS3010]  38.65,66.03 180 bottom
L2  0.47uH  [LPS3010]  72.43,67.58 180 bottom
L3  .56uH  [INDP_LPS4018-472MRB]  63.59,68.03 0 bottom
L4  .56uH  [INDP_LPS4018-472MRB]  49.32,68.06 0 bottom
LST_1  TPTP15SQ  [TP15SQ]  45.46,4.26 0 top
LST_2  TPTP15SQ  [TP15SQ]  49.5,4.25 0 top
LST_3  TPTP15SQ  [TP15SQ]  51.75,4.25 0 top
LST_4  TPTP15SQ  [TP15SQ]  55.83,4.25 0 top
LST_5  TPTP15SQ  [TP15SQ]  57.94,4.23 0 top
LST_RX  TP_HRWN  [TP_HRWN]  51.48,7.86 270 bottom
LST_SEL  TPB1,27  [B1,27]  40.43,29.45 0 bottom
LST_TX  TP_HRWN  [TP_HRWN]  46.02,7.86 270 bottom
PI_PWR_SEL  TP_HRWN  [TP_HRWN]  61.76,3.8 90 top
PIA_I2C_0_C  TPB1,27  [B1,27]  40.94,4.18 180 top
PIA_I2C_0_D  TPB1,27  [B1,27]  43.09,4.56 180 top
PIA_I2C_1_C  TPB1,27  [B1,27]  34.84,4.18 180 top
PIA_I2C_1_D  TPB1,27  [B1,27]  37.25,4.69 180 top
PIA_RUN  TP_HRWN  [TP_HRWN]  54.91,29.96 270 bottom
PIA_SD_SEL  TP_HRWN  [TP_HRWN]  22.01,2.66 180 top
PIB_I2C_0_C  TP_HRWN  [TP_HRWN]  85.51,15.86 180 top
PIB_I2C_0_D  TP_HRWN  [TP_HRWN]  85.51,10.4 180 top
PIB_RUN  TP_HRWN  [TP_HRWN]  63.8,30.09 90 bottom
PIB_SD_SEL  TP_HRWN  [TP_HRWN]  77.64,2.53 90 top
R1  100k  [R0603]  26.71,55.61 270 bottom
R2  100k  [R0603]  29.51,59.55 90 top
R3  0  [R0603]  50.33,42.79 270 bottom
R4  10k  [R0603]  44.87,52.31 90 bottom
R5  10k  [R0603]  46.27,46.98 0 bottom
R6  10k  [R0603]  61.51,43.04 270 bottom
R7  10k  [R0603]  64.05,47.87 270 bottom
R8  0  [R0603]  14.27,36.82 180 top
R9  0  [R0603]  13,57.14 270 bottom
R10  0  [R0603]  14.77,44.69 180 top
R11  10k  [R0603]  26.46,49.9 0 top
R12  1k  [R0603]  26.05,46.73 270 top
R13  0  [R0603]  45.38,49.77 180 bottom
R14  0  [R0603]  69.38,43.42 90 bottom
R15  120  [R0603]  27.35,34.41 0 bottom
R16  120  [R0603]  25.95,39.36 270 bottom
R17  10k  [R0603]  20.11,75.43 270 bottom
R18  5.2k  [R0805]  13.5,78.73 180 top
R19  10k  [R0603]  27.6,67.17 90 bottom
R20  10k  [R0603]  28.62,63.23 270 bottom
R21  12k 1%  [R0603]  19.85,60.69 90 bottom
R22  0  [R0805]  28.62,59.68 270 bottom
R23  DNP  [R0805]  30.65,60.19 90 bottom
R24  0  [R0603]  20.62,54.09 90 bottom
R25  DNP  [R0603]  18.71,54.09 270 bottom
R26  0  [R0603]  29.38,55.99 90 bottom
R27  DNP  [R0603]  31.28,55.99 270 bottom
R28  1M  [R0603]  20.87,65.27 180 top
R29  0  [R0805]  30.39,57.01 0 top
R30  1k  [R0603]  26.43,44.12 180 top
R31  10k  [R0603]  19.6,50.28 180 top
R32  1k  [R0603]  21.38,46.98 270 top
R33  1k  [R0603]  22.39,44.44 180 top
R34  50k  [R0603]  9.21,34.21 180 top
R35  50k  [R0603]  9.21,32.43 180 top
R36  50k  [R0603]  9.21,30.65 180 top
R37  0  [R0603]  9.44,63.74 90 top
R38  1k  [R0603]  9.82,84.32 180 top
R39  1k  [R0603]  9.82,60.44 270 top
R40  1k  [R0603]  9.19,36.18 0 top
R41  50k  [R0603]  9.21,26.71 180 top
R42  50k  [R0603]  9.21,24.81 180 top
R43  50k  [R0603]  66.89,34.66 90 top
R44  50k  [R0603]  68.88,34.66 90 top
R45  50k  [R0603]  64.94,34.66 90 top
R46  50k  [R0603]  63.03,34.66 90 top
R47  50k  [R0603]  61.13,34.66 90 top
R48  50k  [R0603]  9.21,15.92 180 top
R49  50k  [R0603]  9.21,17.7 180 top
R50  50k  [R0603]  9.21,14.14 180 top
R51  50k  [R0603]  9.21,10.33 180 top
R52  50k  [R0603]  9.21,8.3 180 top
R53  50k  [R0603]  62.63,18.81 270 top
R54  50k  [R0603]  60.6,18.81 270 top
R55  50k  [R0603]  64.66,18.81 270 top
R56  50k  [R0603]  67.45,18.81 270 top
R57  50k  [R0603]  69.49,18.81 270 top
R58  8.06k 1%  [R0603]  42.21,60.95 0 bottom
R59  330  [R0603]  11.47,39.87 270 top
R60  8.06k 1%  [R0603]  75.61,62.09 0 bottom
R61  330  [R0603]  11.73,54.34 270 top
R62  1k  [R0603]  78.2,93.79 0 top
R63  1k  [R0603]  28.74,93.84 0 top
R64  120  [R0603]  18.46,93.84 0 top
R65  120  [R0603]  67.48,93.79 0 top
R66  100k  [R0603]  50.33,45.84 270 bottom
R67  100k  [R0603]  61.51,49.14 270 bottom
R68  1k  [R0603]  24.43,3.54 0 top
R69  1k  [R0603]  74.21,4.18 180 top
R70  330  [R0603]  11.47,47.23 270 top
R71  1k  [R0603]  5.76,32.37 0 top
R72  1k  [R0603]  5.63,27.04 0 top
R73  1k  [R0603]  46.78,79.49 90 top
R74  1k  [R0603]  85,79.24 90 top
R75  1k  [R0603]  3.73,21.2 270 top
R76  453k 1%  [R0603]  44.87,67.04 180 bottom
R77  100k 1%  [R0603]  45,70.73 180 bottom
R78  32k 0.1%  [R0603]  45,73.52 180 bottom
R79  1k  [R0603]  4.36,75.05 0 top
R80  453k 1%  [R0603]  59.35,65.14 180 bottom
R81  100k 1%  [R0603]  59.22,69.2 180 bottom
R82  32k 0.1%  [R0603]  59.35,73.27 180 bottom
R83  10k  [R0603]  57.57,15.86 0 top
R84  10k  [R0603]  53.51,15.74 180 top
R85  10k  [R0603]  51.86,21.45 180 top
R86  10k  [R0603]  48.81,21.45 180 top
R87  0  [R0805]  22.65,74.28 270 bottom
R88  0  [R0603]  50.97,37 0 bottom
R89  0  [R0603]  71.8,46.72 180 bottom
R91  0  [R0603]  61.51,46.09 270 bottom
RPI_OTG  TPB1,27  [B1,27]  17.57,77.33 0 bottom
RPIA_1V8  green  [SML0603]  15.54,93.97 0 top
RPIA_3V3  green  [SML0603]  25.7,93.97 0 top
RPIA_RUN  Amber  [SML0603]  48.56,79.62 90 top
RPIA_RX_LST  TP_HRWN  [TP_HRWN]  49.83,24.25 180 bottom
RPIA_SD_SEL  red  [SML0603]  27.22,3.29 180 top
RPIA_TX_LST  TP_HRWN  [TP_HRWN]  47.54,19.17 0 bottom
RPIA_USB_N  TPB1,27  [B1,27]  33.6,39.31 0 top
RPIA_USB_P  TPB1,27  [B1,27]  33.77,40.88 0 top
RPIB_1V8  green  [SML0603]  64.3,93.97 0 top
RPIB_3V3  green  [SML0603]  74.97,93.97 0 top
RPIB_RUN  Amber  [SML0603]  86.78,79.36 90 top
RPIB_SD_SEL  red  [SML0603]  71.16,4.18 0 top
RPIB_USB_N  TPB1,27  [B1,27]  68.88,39.48 0 top
RPIB_USB_P  TPB1,27  [B1,27]  68.88,41.39 0 top
RTC_VIN  TPB1,27  [B1,27]  58.72,46.98 0 top
RX_Y  JUMPER-SMT_3_1-NC_PASTE_SILK  [SMT-JUMPER_3_1-NC_PASTE_SILK]  24.68,29.96 90 bottom
RX_Z  JUMPER-SMT_3_1-NC_PASTE_SILK  [SMT-JUMPER_3_1-NC_PASTE_SILK]  24.68,33.26 90 bottom
S1  AAT4616  [AAT4616]  14.06,39.74 90 top
S2  AAT4616  [AAT4616]  14.01,54.34 90 top
S3  AAT4616  [AAT4616]  13.76,47.49 90 top
S4  FSUSB42MUX  [FSUSB42MUX]  25.44,71.62 270 top
S5  FSUSB42MUX  [FSUSB42MUX]  17.57,71.62 270 bottom
S6  FSUSB42MUX  [FSUSB42MUX]  46.42,27.2 90 bottom
S7  FSUSB42MUX  [FSUSB42MUX]  28.87,22.34 270 top
S8  FSUSB42MUX  [FSUSB42MUX]  53.13,12.94 90 top
S9  FSUSB42MUX  [FSUSB42MUX]  49.95,18.66 90 top
S10  FSUSB42MUX  [FSUSB42MUX]  20.36,11.8 270 top
S_USB_F  TP_HRWN  [TP_HRWN]  22.77,70.98 90 bottom
S_USB_RPI  TP_HRWN  [TP_HRWN]  26.33,70.98 90 bottom
T_RX  TP_HRWN  [TP_HRWN]  21.38,42.53 180 bottom
T_TX  TP_HRWN  [TP_HRWN]  21.12,50.91 180 bottom
TILE  green  [SML0603]  5.63,28.69 180 top
TILE_1  TPTP15SQ  [TP15SQ]  4.87,36.95 0 bottom
TILE_2  TPTP15SQ  [TP15SQ]  5.22,40.58 0 bottom
TILE_3  TPTP15SQ  [TP15SQ]  5.2,42.84 0 bottom
TILE_4  TPTP15SQ  [TP15SQ]  5.07,46.52 0 bottom
TILE_5  TPTP15SQ  [TP15SQ]  5.07,48.5 0 bottom
TILE_RX  Green  [SML0603]  26.55,41.05 180 top
TILE_TX  Red  [SML0603]  26.55,42.23 180 top
TX_A  JUMPER-SMT_3_1-NC_PASTE_SILK  [SMT-JUMPER_3_1-NC_PASTE_SILK]  22.39,39.61 90 bottom
TX_B  JUMPER-SMT_3_1-NC_PASTE_SILK  [SMT-JUMPER_3_1-NC_PASTE_SILK]  22.39,36.31 90 bottom
U1  ICM-20948  [QFN40P300X300X105-24N]  65.95,53.84 270 top
U2  SN74LV1T34  [SOT23-5]  48.66,37.67 0 top
U3  ICM-20948  [QFN40P300X300X105-24N]  48.56,48.76 180 top
U4  FSSD06-MLP  [FSSD06-MLP]  85.61,24.98 90 bottom
U5  ADM6316  [AMD6316]  42.84,47.61 270 bottom
U6  ADM6316  [AMD6316]  73.07,43.04 180 bottom
U7  Value  [RWY0009A]  38.14,62.6 270 bottom
U8  USB2517I-JZX  [QFN50P900X900X100-65N]  23.16,58.92 0 top
U9  SN74LV1T34  [SOT23-5]  23.16,18.53 0 top
U10  SN74LV1T34  [SOT23-5]  27.35,17.13 180 top
U11  FSSD06-MLP  [FSSD06-MLP]  16.58,22.27 270 top
U12  MCP7940MT-I/SN  [SOIC8-N_MC]  54.91,49.9 270 top
U13  FSSD06-MLP  [FSSD06-MLP]  67.07,24.98 270 top
U14  FSSD06-MLP  [FSSD06-MLP]  4.39,22.01 90 bottom
U15  Value  [RWY0009A]  71.8,64.12 270 bottom
U16  Value  [RWY0009A]  49.57,72 90 bottom
U17  Value  [RWY0009A]  63.67,72.12 90 bottom
U18  RH100  [RH100]  21.63,67.55 0 top
U19  SN74LV1T34  [SOT23-5]  50.82,42.77 0 top
U20  COMPUTE_MODULE  [SO-DIMM]  39.59,37.73 90 top
U21  COMPUTE_MODULE  [SO-DIMM]  77.33,37.72 90 top
U22  SN74LV1T34  [SOT23-5]  47.26,42.53 0 top
U23  SN74LV1T34  [SOT23-5]  70.04,54.46 180 top
U24  SN74LV1T34  [SOT23-5]  70.03,59.23 180 top
U25  SN74LV1T34  [SOT23-5]  70.06,49.6 0 top
USB_F_VBUS  red  [SML0603]  3.73,86.6 0 top
USB_SUSP_IND  TPTP18SQ  [TP18SQ]  31.51,59.55 0 top
VIS  green  [SML0603]  5.76,33.9 180 top
VIS_1  TPTP15SQ  [TP15SQ]  7.97,39.97 0 top
VIS_2  TPTP15SQ  [TP15SQ]  4.49,42.15 0 top
VIS_3  TPTP15SQ  [TP15SQ]  4.49,44.31 0 top
VIS_5V  red  [SML0603]  10.71,37.83 0 top
W_RES_A  TP_HRWN  [TP_HRWN]  55.64,38.47 0 bottom
W_RES_B  TP_HRWN  [TP_HRWN]  85,47.61 270 top
WD_A_MR  TPTP18SQ  [TP18SQ]  48.43,35.04 0 bottom
WD_A_WDI  TPB1,27  [B1,27]  33.19,31.99 0 top
WD_B_MR  TPTP18SQ  [TP18SQ]  85,44.06 0 top
WD_B_WDI  TPB1,27  [B1,27]  76.62,42.15 0 bottom
WD_RES_A  TPTP18SQ  [TP18SQ]  52.49,38.85 0 bottom
WD_RES_B  TPTP18SQ  [TP18SQ]  85,49.9 0 top
X1  1040310811  [1040310811]  8.96,30.4 90 bottom
X2  1040310811  [1040310811]  8.96,13.89 90 bottom
X4  TC-135  [TC-135]  56.18,54.34 0 top
X5  1040310811  [1040310811]  79.26,33.36 270 bottom
X6  1040310811  [1040310811]  79.26,16.85 270 bottom

## Tracks (layer width: path | path; a pad name or v marks a point on that pad's centre or on a via)
1
  Bottom 0.406: U17.5 62.02,71.36 60.07,69.42 R81.2 58.37,67.5 C24.2 58.5,67.04 R80.1
2
  Bottom 0.406: U16.5 47.29,71.24 46.78,70.73 R77.2 44.15,69.03 C16.2 44.15,67.17 R76.1
3
  Bottom 0.254: L3.1 65.49,68.16 65.49,69.1 63.67,70.92 U17.3
3V3_SW_2  (via drill 0.3)
  Top 0.254: v88.56,72.12 88.56,73.32 ANT_1.TP
  Top 0.406: J9.1 84.88,68.44 v88.56,72.12
  Route14 0.406: v88.56,72.12 88.56,79.11 78.02,89.65 38.76,89.65 38,88.9 38,87.73 36.84,86.56 H2-CONNECTOR1.19
3V3_SW_3  (via drill 0.3)
  Top 0.508: v11.34,62.98 11.34,66.57 24.86,80.09 33.51,80.09 H2-CONNECTOR1.20
  Bottom 0.254: GPS_1.TP 8.5,55.61 8.68,55.44 J10.1
  Bottom 0.508: J10.1 9.54,54.83 10.2,55.49 10.2,61.84 v11.34,62.98
5V_BUS  (via drill 0.3)
  Top 0.254: LST_1.TP 47.92,6.72 v48.17,6.72
  Top 0.559: J3.1 48.07,6.82 v48.17,6.72
  Bottom 0.635: H2-CONNECTOR1.25 H2-CONNECTOR1.26 44.45,81.36 JP4.3
  pour Route14: 46.14,3.04 46.14,7.61 47.54,9 72.94,9 84.12,20.18 84.12,80.76 78.4,86.47 45.89,86.47 45.63,86.22 45.63,85.46 45,84.82 43.98,84.82 43.35,84.82 42.71,85.46 42.71,89.02 43.35,89.65 78.02,89.65 88.56,79.11 90.21,79.11 90.21,0.88 88.31,-1.03 50.21,-1.03
5V_SW_2
  Bottom 0.635: H2-CONNECTOR1.15 33.06,84.64 39.88,84.64 40.61,83.92 40.61,82.23 43.15,79.69 JP4.1
7
  Bottom 0.254: L4.1 51.09,68.82 49.57,70.34 U16.3
12V_BUS  (via drill 0.35)
  Top 0.254: BB_1.TP 11.51,4.92 J11.1
  Top 0.508: J11.1 11.47,5.62 11.47,6.59 11.09,6.97 7.53,6.97 2.07,12.43 2.07,32.75 4.11,34.79 v4.11,35.67
  Route3 0.508: H2-CONNECTOR1.23 H2-CONNECTOR1.24 36.85,78.35 9.19,78.35 3.98,73.14 3.98,62.22 4.99,61.2 4.99,36.56 v4.11,35.67 v4.11,34.91
12V_SW_1  (via drill 0.3)
  Top 0.508: v10.58,65.39 10.58,68.95 21.59,79.96 H2-CONNECTOR1.8
  Route3 0.508: v6.77,39.74 6.77,43.04 7.92,44.18 7.92,59.42 10.58,62.09 v10.58,65.39
  Bottom 0.254: TILE_1.TP 7.11,39.19 7.11,39.4
  Bottom 0.508: J6.1 7.11,39.4 v6.77,39.74
+1V8_RPIA  (via drill 0.3)
  Top 0.203: v46.27,51.01 46.27,50.37 46.88,49.76 U3.13 47.33,49.76 47.36,49.73 48.55,49.73 48.56,49.73 49.02,49.73 49.16,49.86 U3.8 | U20.186 33.64,70.43 32.43,71.64 32.43,77.33 v30.65,79.11 | R64.2 21.09,92.06 29.76,92.06 30.65,91.17 v30.65,81.14
  Top 0.305: U22.5 46.31,43.64 v45.66,42.99 | U19.5 49.39,43.59 v49.39,42.89 | U2.5 47.71,39.91 v47.79,39.99
  Route3 0.203: v30.65,81.14 v30.65,79.11
  Route14 0.254: v49.39,42.89 48.43,41.92 48.43,40.63 v47.79,39.99 45.66,42.12 v45.66,42.99 45.66,43.83 46.52,44.69 46.52,50.75 v46.27,51.01
  Route14 0.305: v40.43,63.87 41.75,62.55 42.32,62.55 43.6,61.26 43.6,53.67 v46.27,51.01
  Bottom 0.203: v46.27,51.01 46.56,51.3 C57.1 C31.1 | 1V8_RPIA.TP 37.81,76.7 38.84,75.67 C79.1
  Bottom 0.381: C12.1 38.84,70.29 C80.1 C79.1
  other vias: 41.83,69.97 41.44,69.33 40.05,71.49 40.17,70.85 41.44,70.6 40.81,71.23
  pour Top: 34.71,71.62 45,71.62 47.16,69.46 47.16,68.69 34.71,68.69
  pour Bottom: 38.78,71.74 40.68,71.74 42.08,70.35 42.08,69.46 41.32,68.69 41.32,63.49 40.43,62.6 39.28,62.6 38.9,62.98 38.9,63.87 39.67,64.63 39.67,66.92 38.78,67.81
+1V8_RPIB  (via drill 0.3)
  Top 0.203: U1.13 64.97,52.28 64.97,51.91 65.18,51.69 C88.1 | U1.8 63.96,54.44 63.8,54.6 63.8,56.16 C89.1 | v76.69,78.22 78.53,80.06 78.53,91.43 77.64,92.32 69.8,92.32 R65.2
  Top 0.254: 63.8,54.6 63.79,54.59 63.28,54.59 63.03,54.34 63.03,51.18 63.64,50.57 C88.1 | U25.5 69.11,51.02 70.99,52.9 U23.5 71.67,53.83 71.67,57.24 U24.5 70.32,57.93 69.54,58.71 64.76,58.71 64.68,58.79
  Top 0.305: C89.1 64.68,58.79 64.68,62.97 71.29,69.58 | 71.29,69.58 71.54,69.84 73.41,69.84 U21.184 | C71.1 71.29,69.58
  Bottom 0.203: 1V8_RPIB.TP 77.64,67.55 v75.86,69.33 | v76.69,78.22 75.87,77.4 C82.1
  other vias: 75.86,70.73 75.23,70.47 75.86,70.09 75.23,69.71
  pour Top: 72.43,70.98 82.21,70.98 82.21,68.95 72.43,68.95
  pour Bottom: 73.07,65.77 73.07,66.16 73.58,66.66 73.58,67.81 73.45,67.93 72.81,67.93 72.81,75.81 74.97,75.81 76.11,74.66 76.11,66.79 73.96,64.63 72.81,64.63 72.81,65.52
+3V3  (via drill 0.25, 0.3, 0.35)
  Top 0.203: +3V3_VIN.P$1 82.08,87.36 v81.58,87.36 | R72.2 7.28,26.24 v7.28,25.26 | R71.2 5.87,33.11 v5.87,33.12
  Top 0.254: U8.64 19.41,63.6 19.27,63.74 v17.7,63.74 16.97,63.74 C46.1 | v23.05,64.25 22.91,64.1 U8.57 | U8.52 25.41,62.76 v25.7,62.47 | S4.1 22.48,72.62 22.05,73.04 C34.1 v21.12,74.16 | U8.10 17.77,58.17 v17.76,58.15 | U8.5 17.65,60.67 v17.31,60.33 | S2.5 14.33,55.29 v14.24,55.39 | S3.5 14.92,48.59 C8.1 | C45.1 29.42,61.67 U8.46 27.05,61.67 26.84,61.46 26.84,60.95 27.12,60.67 U8.44 | C40.1 25.93,53.77 24.36,53.77 24.05,53.45 24.05,52.57 C84.1 C41.1 22.9,52.86 v22.9,53.58 v22.91,53.59 U8.24 | S8.1 57.68,11.94 C78.1 58.65,12.22 v58.77,12.1 | S9.1 53.99,17.66 C77.1 54.87,17.81 v55.16,17.51 | C52.1 27.51,24.25 v27.77,23.99 27.77,23.52 27.59,23.34 S7.1 | S10.1 19.08,12.8 v19.47,13.2 19.47,13.92 C90.1 | U9.5 21.41,19.83 v21.38,19.8 | R86.2 47.71,21.2 v47.03,21.2 | R85.1 52.71,22.68 v52.75,22.72 | R84.2 v51.73,15.74 | R83.2 v59.35,15.86 | R40.2 v10.96,36.18 | R79.2 6,74.25 v6,74.16 | R29.2 31.34,56.87 v30.43,55.96 | v12.05,64 12.14,63.91 C48.1 C42.1 15.37,64.5 v15.66,64.5 | C83.1 30.71,62.45 v30.5,62.45 | R39.2 9.15,58.92 v9.06,58.92 | R75.2 4.96,20.35 v6.14,19.17
  Top 0.305: C8.1 16.04,50.28 v15.65,50.67
  Top 0.381: C42.1 C46.1 | C45.1 C83.1
  Bottom 0.254: R5.2 44.72,46.27 IC4.5 45.57,45.01 v45.63,45.07 | IC6.5 66.15,46.16 v66.08,46.09 65,45.01 IC5.5 | IC7.16 57.57,40.63 v57.45,40.76 | v57.19,42.02 57.32,41.9 IC7.15 59.12,41.77 61.09,41.77 R6.2 | R66.2 51.1,44.98 51.64,44.44 IC7.4 54.78,44.44 v54.91,44.31 | v57.57,48.38 57.7,48.25 IC7.10 61.51,48.25 R67.2 62.87,48.29 64.05,47.1 R7.2 | C44.1 v23.05,64.25 | v25.7,62.47 25.71,62.48 26.38,62.48 C43.1 | S5.1 18.85,72.62 18.42,73.05 C35.1 18.42,75.08 v18.33,75.17 | v17.31,60.33 16.5,60.33 C86.1 C47.1 | v17.76,58.15 17.5,58.4 C85.1 | v14.24,55.39 14.3,55.45 C6.1 | S6.1 45.21,26.2 45.55,25.86 | C51.1 45.55,25.86 | C33.1 75.41,42.79 72.96,42.79 U6.5 71.33,41.94 v71.31,41.92 | 45.55,25.86 v46.14,25.86 | IC7.14 v57.19,43.17 | U16.8 50.57,72.88 v51.07,73.38 | U17.8 64.67,73.59 v64.72,73.65 | C32.1 42.59,50.09 | 42.59,50.09 41.76,50.09 v41.57,49.9 | 42.59,50.09 42.78,50.09 44.04,51.36 44.04,52.37 44.83,53.16 R4.2 45.13,53.42 v45.13,53.96 | 42.59,50.09 41.74,49.25 U5.5 | R19.2 26.42,68.02 v26.4,68 | v30.43,55.96 31.24,55.15 R27.2 | R1.2 26.89,54.58 v27.73,54.58 | R25.2 17.91,53.24 v17.82,53.33
  Bottom 0.381: C43.1 28.44,62.56 R20.2 28.88,62.38 29.65,63.15 | 29.65,63.15 29.65,64.87 v29.63,64.89 | 29.65,63.15 29.65,62.14 R23.2
  other vias: 26.08,53.58 30.52,61.71
  pour Route14 (rank 3): -0.59,-0.27 -0.59,96 89.96,96 89.96,-0.27
+3V3_RPIA  (via drill 0.3)
  Top 0.203: R63.2 30.65,93.84 32.94,91.56 v32.94,81.14 | v32.94,79.11 32.94,76.31 v34.2,75.05
  Top 0.254: 16.32,22.78 v17.34,22.78 17.6,22.52 U11.6 | 16.32,22.78 15.51,23.59 15.51,23.75 15.24,24.02 U11.22 14.36,24.02 13.63,24.75 13.63,27.93 11.85,29.71 8.34,29.71 | 16.32,22.78 16.32,21.6 15.24,20.52 U11.15 14.22,20.52 12.74,19.04 12.74,14.34 11.6,13.2 8.36,13.2 | R52.2 R51.2 8.36,12.18 | 8.36,12.18 8.36,13.2 | 8.36,13.2 R50.2 | R49.2 R48.2 R50.2 | R50.2 7.91,13.69 v7.15,13.69 | R34.2 R35.2 R36.2 | 8.34,29.71 8.34,30.62 R36.2 | R42.2 R41.2 8.36,28.54 C76.1 8.34,29.71 | R36.2 7.91,30.2 v7.28,30.2 | C75.1 8.36,12.18 | U20.4 36.95,12.23 v37.25,11.93 36.96,11.63 U20.2 | C28.1 5.36,21.29 v5.15,21.51
  Route3 0.203: v32.94,79.11 v32.94,81.14
  Route3 0.508: v17.34,22.78 19.3,20.82 23.16,20.82 v32.68,30.34
  Bottom 0.203: 3V3_RPIA.P$1 39.54,55.99 v39.92,56.38
  Bottom 0.254: X2.4 v7.15,13.69 6.61,13.69 1.84,18.46 1.84,19.98 2.13,20.27 U14.22 3.05,20.27 3.88,21.09 | 3.88,21.09 4.73,21.09 v5.15,21.51 5.41,21.77 U14.6 | v17.34,22.78 17.68,23.12 C29.1 | X1.4 v7.28,30.2 7.28,30.12 1.84,24.68 1.84,24.05 2.13,23.77 U14.15 3.22,23.77 3.88,23.11 3.88,21.09 | C65.1 40.69,26.4 v39.92,26.4 | C25.1 37.09,12.09 v37.25,11.93 | U7.8 37.14,60.46 C10.1 36.49,59.93 37.64,61.09 U7.2 37.64,63.87 37.14,63.87 U7.1
  Bottom 0.406: C16.1 45.85,67.17 R76.2
  other vias: 37.38,27.04 35.73,26.28 43.6,25.52 41.77,26.91 43.48,23.48 41.7,22.72 37.38,23.1 35.48,23.86 45.51,65.39 46.27,65.39 47.03,65.39 46.83,70.09 40.81,72.5 40.81,73.39 40.81,74.41 43.48,75.3 42.59,75.3 34.2,74.28 34.15,72.63 34.15,71.9 39.92,57.01 45,58.79 41.8,57.01 37.89,57.65 39.28,56.63 45.89,58.79 45.76,60.44
  pour Top: 34.46,27.29 44.37,27.29 44.37,22.59 40.43,22.59 39.28,21.45 39.28,12.69 37.76,11.16 34.59,11.16 34.46,11.29
  pour Bottom: 46.02,70.73 48.56,70.73 48.56,69.33 47.92,68.69 47.92,67.3 48.43,66.79 48.43,58.28 48.05,57.9 48.05,57.39 46.52,55.87 38.9,55.87 35.98,58.79 35.98,60.69 37.51,60.69 37.76,60.44 37.76,58.79 38.9,57.65 43.22,57.65 45.13,59.55 45.13,69.84
  pour Route14 (rank 2): 32.81,72 32.81,75.55 34.33,77.08 48.56,77.08 50.08,75.55 50.08,59.68 40.81,50.41 40.81,32.63 44.87,28.56 44.87,22.47 43.35,20.94 34.84,20.94 32.3,23.48 32.3,71.49
  pour Top (rank 2): 33.82,71.23 45.51,71.23 45.76,71.49 45.76,74.54 44.75,75.55 33.7,75.55 33.32,75.17 33.32,71.74
+3V3_RPIB  (via drill 0.3)
  Top 0.203: R62.2 79.05,74.42 v78.78,74.16 | 3V3_RPIB.P$1 82.72,75.81 U21.199
  Top 0.254: U21.40 76.07,23.02 v76.24,22.85 76.37,22.72 | R54.2 R53.2 R55.2 v66.21,17.96 R56.2 R57.2 | R47.2 R46.2 63.2,35.51 | 63.2,35.51 R45.2 R43.2 R44.2 | U13.22 65.88,26.73 67.22,25.39 v67.73,25.39 | 82,24.16 81.45,23.61 | v64.94,27.42 64.94,32.35 64.05,33.24 64.05,34.66 63.2,35.51
  Top 0.305: C70.1 68.88,13.49 C69.1 70.65,13.23 71.67,12.22 U21.4 | U21.2 71.72,11.62 v71.67,11.67 v71.67,12.18
  Top 0.381: 82.72,22.72 82.88,22.72 C91.1 83.61,23.61 84.16,24.16
  Top 0.406: 76.37,22.72 U21.39 82.72,22.72 | v86.38,24.47 86.06,24.16 C56.1 84.16,24.16 | R57.2 69.51,17.93 v69.51,17.13
  Bottom 0.254: X5.4 80.09,33.56 81.81,31.84 81.81,28.03 83.1,26.73 U4.15 84.37,26.73 85.62,25.49 85.62,24.47 | X6.4 80.22,17.05 82.82,19.65 82.82,22.7 83.36,23.23 U4.22 84.37,23.23 85.62,24.47 | 85.62,24.47 v86.38,24.47 86.63,24.73 U4.6 | C55.1 68.18,25.83 v67.73,25.39 | U15.8 70.8,61.86 C13.1 70.27,61.2 71.3,62.23 U15.2 71.3,65.52 70.8,65.52 U15.1
  other vias: 80.31,26.22 65.7,20.94 69.13,64.76 68.37,64.76 68.37,64.12 69.13,64.12 67.99,63.11 68.75,63.11 67.99,62.47 68.75,62.34 67.86,60.31 67.86,61.08 67.99,61.71 76.62,74.16 77.38,74.16 78.15,74.16 76.75,73.39 77.51,73.39 78.27,73.39 78.91,73.39 71.67,26.53 72.81,26.4 79.29,26.15 78.4,26.15 77.13,22.85 75.48,12.18 77.64,15.48 65.7,27.42
  pour Top: 71.54,71.87 84.12,71.87 84.37,72.12 84.37,74.79 82.97,76.19 72.31,76.19 70.82,74.71 70.82,72.59
  pour Top: 72.18,27.29 82.21,27.29 82.21,22.59 66.34,22.59 66.34,19.55 67.1,18.78 70.78,18.78 70.78,17.39 69.89,16.5 60.37,16.5 59.73,17.13 59.73,19.04 59.99,19.29 64.3,19.29 64.3,27.93 64.69,28.31 71.16,28.31
  pour Bottom: 59.61,67.81 62.27,70.47 62.27,67.81 63.8,66.28 66.97,66.28 67.73,65.52 71.16,65.52 71.42,65.27 71.42,62.34 71.16,62.09 71.16,59.04 70.15,58.03 64.56,58.03 63.92,58.66 63.92,65.52 61.38,65.52 61,65.14 61,64.38 60.75,64.12 59.61,64.12
  pour Top: 72.31,12.56 74.84,12.56 76.37,14.08 76.37,22.85 76.62,23.1 82.08,23.1 82.08,16.5 76.75,11.16 72.31,11.16
  pour Route14 (rank 2): 84.24,20.31 75.29,11.35 71.34,11.35 64.56,22.85 64.56,28.82 72.05,36.31 72.05,75.93 72.56,76.44 83.23,76.44 84.24,75.43
  pour Route14: 72.43,66.03 67.48,66.03 67.35,65.9 67.35,59.8 67.48,59.68 69.77,57.39 72.43,57.39
+5V  (via drill 0.3)
  Top 0.152: C74.1 56.77,45.58 | U12.8 56.77,47.5
  Top 0.203: RTC_VIN.TP 57.06,45.33 C74.1
  Top 0.254: C4.1 15.69,40.69 S1.5 13.36,42.41 12.49,42.41 12.25,42.17 D1.4 | R31.1 21.38,49.35 v21.38,48.76 | R33.1 23.24,45.96 R32.1 | R30.1 27.22,44.18 | R11.1 25.78,49.73 | R12.1 25.98,47.65 25.78,47.85 | D2.4 12.6,49.28 v12.62,49.26 | D3.4 13.11,56.39 13.68,55.82 13.68,55.08 14.27,54.5 14.27,53.33 13.63,52.69 v13.63,51.3 | U10.5 28.92,16.46 28.92,19.03 28.7,19.26 28.7,23.95 28.38,24.26 28.38,28.08 31.41,31.1 31.41,35.04 v31.28,35.17
  Top 0.305: 25.81,47.83 R12.1 | C74.1 56.74,45.04 | 56.05,43.58 v56.05,43.55
  Top 0.381: C26.1 29.05,48.17 v29.28,47.94
  Top 0.406: 56.77,45.58 56.77,47.5 | v21.38,48.76 R32.1 25.81,47.83 | 27.22,44.18 27.22,46.44 26.08,47.58 R12.1 27.61,47.58 C26.1 | 25.78,47.85 25.78,49.73 | v24.62,44.77 24.62,45.78 25.06,46.22 25.06,46.72 25.98,47.65 | v17.31,42.91 17.44,42.79 17.44,40.87 C4.1 | v56.18,50.91 56.81,50.28 U12.8 | 56.74,45.04 56.74,44.27 56.05,43.58
  Route3 0.254: v13.63,51.3 13.63,50.28 v12.62,49.26
  Route3 0.406: v12.62,49.26 14.24,47.64 v15.13,47.64 17.31,45.45 v17.31,42.91 | v56.05,43.55 53.26,43.55 50.21,46.6 39.02,46.6 38.47,46.05 38.47,46.04 36.24,43.8 36.24,40.55 33.27,37.58 | 33.27,37.58 v31.54,37.58 31.92,37.2 v32.68,37.2 32.88,37.2 33.27,37.58
  Bottom 0.203: +5V_VIN.P$1 56.18,81.14
  Bottom 0.254: 20.75,47.95 C50.1 | IC3.4 24.56,44.7 v24.62,44.77 | IC9.1 34.2,39.99 34.2,41.22 C27.1 | C62.1 51.1,74.41 50.07,73.39 U16.2 50.07,70.48 50.08,70.47 50.59,70.47 50.59,71.22 U16.1 | C64.1 64.94,75.17 64.17,74.4 U17.2 64.17,72.07 64.67,71.57 U17.1 | 15.16,47.61 v15.13,47.64
  Bottom 0.381: v29.28,47.94 29.29,47.95 IC3.20
  Bottom 0.406: v21.38,48.76 21.38,48.34 C50.1 | 20.75,47.95 IC10.20 15.5,47.95 15.16,47.61 | v33.81,43.18 33.6,42.97 33.6,41.83 C27.1 | v56.18,50.91 55.67,50.91 51.86,54.73 51.86,58.03 52.87,59.04 52.87,77.14 C58.1
  Bottom 0.635: JP4.2 46.91,80.51 47.54,81.14 50.08,81.14 | 50.08,81.14 50.65,80.57 C58.1 C59.1 50.65,75.75 C62.1 | 50.08,81.14 56.18,81.14 63.67,81.14 64.49,80.32 C20.1 C21.1 64.49,75.75 C64.1
  other vias: 32.17,37.58
  pour Route14: 10.71,50.03 27.73,50.03 35.6,42.15 35.6,35.8 34.2,34.41 18.08,34.41 10.71,41.77
_
  cutout Route2: 8.93,96.25 8.93,90.67 6.65,88.38 -0.34,88.38 -0.34,96.25
_1
  cutout Route14: 8.93,96.25 8.93,90.67 6.65,88.38 -0.34,88.38 -0.34,96.25
_2
  cutout Route3: 8.93,96.25 8.93,90.67 6.65,88.38 -0.34,88.38 -0.34,96.25
_3
  cutout Route15: 8.93,96.25 8.93,90.67 6.65,88.38 -0.34,88.38 -0.34,96.25
BB_BUSY
  Top 0.254: S10.3 17.06,11.8 14.51,9.25 J11.4 14.5,5.56 14.5,4.48 15.59,3.39 16.5,3.39 16.58,3.47 17.78,3.47 BB_4.TP
BB_RX  (via drill 0.35)
  Top 0.203: BB_3.TP 15.19,2.96 v14.69,3.46
  Top 0.254: U10.4 26.4,15.23 19.22,15.23 13.51,9.52 J11.3 13.51,3.81 15.19,2.13 BB_3.TP
  Bottom 0.203: v14.69,3.46 14.77,3.54 BB_RX_SHIFT.P$1
BB_TX
  Top 0.254: U9.2 23.16,16.24 22.77,15.86 18.96,15.86 12.62,9.51 12.62,5.68 J11.2 12.51,4.08 12.9,3.69 BB_2.TP
BB_WDG
  Top 0.254: S10.4 17.2,11.3 15.51,9.62 J11.5 15.61,5.48 15.61,4.51 16.25,3.87 18.81,3.87 BB_5.TP
CAM_PWR_EN  (via drill 0.3)
  Top 0.254: U21.72 71.68,36.22 v71.66,36.2 | S2.4 14.27,52.64 v14.27,51.68 | v14.27,49.39 14.27,47.04 S3.4 14.77,45.71 v14.79,45.7 | v15.03,39.74 15.03,38.84 S1.4 17.64,36.23 v31.46,36.23 U20.72 v37.09,36.22
  Route3 0.254: v71.66,36.2 70.29,37.57 47.53,37.57 v46.65,36.69 | v14.27,51.68 v14.27,49.39
  Route14 0.254: v46.65,36.69 43.86,36.69 43.65,36.48 40.83,36.48 40.57,36.22 v37.09,36.22
  Bottom 0.254: v14.79,45.7 14.79,39.98 v15.03,39.74 | v31.46,36.23 32.55,35.14 32.55,32.63 CAM_EN.P$1
DN_DEBUG  (via drill 0.3)
  Top 0.254: U8.53 24.91,62.55 25.16,62.29 v25.16,61.71 | v8.02,68.19 6.19,68.19 J4.2
  Route3 0.254: v25.16,61.71 24.42,61.71 24.11,61.41 16.03,61.41 9.25,68.19 v8.02,68.19
DN_FLASH  (via drill 0.3)
  Top 0.254: J1.2 5.43,81.67 4.87,81.11 v4.87,81.01
  Bottom 0.254: v4.87,81.01 9.69,76.19 9.69,75.61 13.69,71.62 S5.8
DP_DEBUG  (via drill 0.3)
  Top 0.254: U8.54 v24.41,62.27 v24.4,62.27 | J4.3 5.35,67.55 4.99,67.91 4.99,68.79 v5.02,68.82
  Route3 0.254: v24.4,62.27 23.94,61.81 16.2,61.81 9.19,68.82 v5.02,68.82
DP_FLASH  (via drill 0.3)
  Top 0.254: v8.04,80.96 6.22,80.96 J1.3
  Bottom 0.254: v8.04,80.96 8.04,78.93 10.2,76.77 10.2,75.68 13.77,72.12 S5.9
GND  (via drill 0.25, 0.3, 0.35)
  Top 0.203: C30.2 49.45,51.47 v49.34,51.47 | U3.11 47.97,50.32 47.97,50.66 47.46,51.17 v47.42,51.17 | v45.69,47.99 45.93,47.76 U3.18 47.33,47.76 47.36,47.78 47.76,47.78 47.97,47.57 47.97,47.23 U3.20 | v66.97,51.6 66.95,51.61 U1.18 | U1.18 67.5,52.29 v67.61,52.19 | C88.2 67.61,51.3 v67.86,51.3 | v66.34,56.25 66.38,56.29 C89.2 67.19,57.04 v67.22,57.01 | U1.11 64.42,53.23 64.79,53.23 65.15,52.87 66.93,52.87 | v34.23,69.61 34.61,69.23 | U20.157 44.85,61.73 v44.87,61.71 | U20.163 42.3,63.53 v42.15,63.68 | RPIA_1V8.C v13.38,93.97 | RPIA_3V3.C v24.17,93.97 | RPIB_1V8.C v62.65,93.97 | RPIB_3V3.C v73.45,93.97 | U1.20 67.46,53.2 67.09,53.2 66.93,53.03 66.93,52.87 | U1.18 66.93,52.32 66.93,52.87
  Top 0.254: v5.15,22.52 6.96,22.52 C28.2 | v17.34,21.76 17.6,22.02 U11.7 | v17.59,25.57 17.33,25.31 U11.2 | C53.2 56.85,56.03 v56.68,55.87 | C53.2 56.85,57.73 v56.68,57.9 | C54.1 55.5,57.73 v55.67,57.9 | C54.1 55.5,56.03 v55.67,55.87 | U13.2 67.82,26.37 v67.71,26.25 | U13.7 68.09,24.73 v67.84,24.47 | S4.10 26.86,72.62 v26.59,72.89 26.2,73.27 v26.08,73.27 25.44,73.27 24.55,74.16 C34.2 | S4.5 23.9,70.62 24.17,70.35 v24.17,69.97 | D3.1 11.71,59.16 v11.73,59.17 | S2.2 v13.63,54.34 | IR1_3V3.C 9.82,52.26 9.92,52.36 9.92,53.47 C5.2 10.34,53.88 v10.75,53.88 | v8.68,38.6 9.27,38.6 C3.2 9.96,38.75 VIS_5V.C v9.19,37.83 | S1.2 v14.11,39.74 | C4.2 15.75,41.6 v15.54,41.39 | IR2_3V3.C 9.69,45.7 C7.2 9.02,46.38 v8.68,46.72 | C8.2 16.04,46.22 v15.54,45.71 15.55,45.7 15.55,44.77 R10.1 | J1.5 4.9,79.71 v4.87,79.74 | R37.1 7.11,62.89 J4.SHELL1 | J4.5 6.16,66.26 4.99,66.26 v4.87,66.14 | U21.8 71.71,13.42 v71.67,13.38 | U21.38 75.4,22.42 v75.48,22.34 | U21.32 75.45,20.62 | 75.45,20.62 v75.48,20.65 | U21.1 82.69,11.32 v82.85,11.16 | U21.7 82.54,13.12 v83.61,12.05 | U21.13 82.41,14.92 v82.85,15.36 82.85,16.37 82.5,16.72 U21.19 | U21.25 78.36,18.52 v78,18.89 79.43,20.32 U21.31 | U21.37 83.57,22.12 v83.61,22.09 | v28.11,45.58 28.2,45.68 C26.2 28.23,46.5 v29.09,46.5 | R2.1 29.76,58.7 v30.32,58.15 | v30.27,64.25 29.51,63.49 C45.2 C83.2 31.16,63.7 v31.16,64.38 | v21.78,53.56 21.78,53.44 C41.2 | C84.2 25.03,53.19 v24.96,53.19 | C40.2 v29.63,52.69 | C48.2 v12.87,66.54 | R8.1 14.39,36.09 v14.39,36.06 | U20.86 v37.05,40.43 v37.05,40.42 | v33.48,36.85 33.5,36.83 U20.74 36.86,36.83 v37.08,37.05 | U20.92 36.92,42.23 v37.08,42.38 | v11.22,11.67 10.71,12.18 C75.2
  Top 0.254: v10.96,28.18 10.42,28.18 C76.2 | C78.2 58.76,13.92 v58.84,13.83 | S8.5 56.09,13.94 v56.36,14.21 | S8.10 52.1,11.94 v52.11,11.93 | S9.10 48.75,17.66 v48.83,17.75 | RPIA_SD_SEL.C 27.97,4.17 v27.98,4.18 | RPIB_RUN.C v86.78,77.84 | U21.67 81.31,34.8 v83.26,34.8 | v77.81,33.02 77.91,32.92 U21.61 82.43,32.92 82.59,32.75 82.59,31.36 82.35,31.12 U21.55 | v44.91,32.93 v44.9,32.93 U20.61 42.46,32.93 v41.94,33.45 41.94,34.39 42.28,34.73 U20.67 | v74.87,30.77 74.87,31.15 74.6,31.42 U21.56 72.24,31.42 71.67,31.99 71.67,32.17 v71.69,32.14 | U9.3 25.06,16.28 v25.06,16.12 | U10.3 26.4,19.35 v26.2,19.55 | C90.2 21.5,13.92 v21.5,13.07 21.77,12.8 S10.10 | v25.04,21.27 25.1,21.34 S7.5 | v16.55,6.72 16.51,6.68 J11.6 16.51,4.47 v16.55,4.43 | v16.81,2.91 16.81,1.76 J11.G2 17.63,1.7 v17.7,1.77 | v10.33,1.89 10.97,1.89 J11.G1 11.16,2.85 v11.22,2.91 | S7.10 30.16,23.34 v29.89,23.61 29.89,24.21 C52.2 | U20.44 34.34,27.83 v34.32,27.81 | U20.50 34.41,29.63 v34.33,29.71 | U20.56 37.01,31.43 v37.53,30.9 | v47.79,5.58 47.72,5.5 J3.G1 v47.06,4.31 | v54.12,4.31 J3.G2 53.41,4.33 v53.41,5.75 | J9.4 85.52,64.53 86.82,63.23 J9.G2 v88.69,63.23 | v88.81,68.82 v88.81,68.83 J9.G1 87.32,68.69 v86.15,68.69 | v53.51,51.17 53,51.68 U12.4 | U20.109 41.83,47.33 v41.83,47.36 | U20.115 44.87,49.14 v45.25,48.76 | U20.121 42.12,50.93 v41.68,51.37 | RPIA_RUN.C 48.56,78.37 47.81,77.63 v47.43,77.63 | S3.2 v13.76,46.47 | S10.5 17.4,10.8 17.19,10.59 v17.19,10.15 | U20.38 36.87,22.43 | 36.87,22.43 v36.89,22.45 | U20.32 37.07,20.63 37.13,20.69 37.13,22.17 36.87,22.43 | U20.26 37.03,18.83 v37.08,18.78 | U20.20 37.1,17.03 v37.08,17.01 | U20.14 v37.08,15.23
  Top 0.254: U20.8 37.06,13.43 v37.08,13.45 | U20.68 v34.08,35.03 | v34.08,35.03 33.96,35.03 v33.52,35.47 | U21.43 82.44,27.52 82.72,27.8 v82.72,28.31 82.72,29.07 82.47,29.33 U21.49 | v79.77,36.01 79.95,36.18 79.95,36.21 80.26,36.52 U21.73 | U21.79 82.36,38.32 v82.85,37.83 | U21.85 82.72,40.12 v82.85,40.25 | U21.91 82.74,41.92 v82.85,42.02 | U21.97 82.63,43.72 v82.85,43.5 | U21.103 82.71,45.52 v82.85,45.66 | U21.109 82.63,47.32 v82.85,47.1 | U21.115 79.89,49.12 v79.42,48.64 | U21.121 81.1,50.79 79.79,50.79 v79.42,51.17 | U21.127 79.44,52.72 v79.42,52.69 | U21.133 79.67,54.52 v79.42,54.77 | U21.139 79.49,56.32 v79.42,56.25 | U21.145 79.7,58.12 v79.67,58.15 | U21.151 79.68,59.92 v79.67,59.93 | U21.157 v79.68,61.72 v79.67,61.71 | U21.163 79.7,63.52 v79.67,63.49 | U21.169 80.11,65.32 v79.67,64.89 | U21.181 79.7,68.92 v79.67,68.95 | U21.187 v79.68,70.72 v79.67,70.73 | U21.195 81.25,73.14 v82.59,73.14 | U21.196 74.95,73.42 v74.97,73.39 | U21.188 74.97,71.02 v74.97,71.23 | U21.182 74.57,69.22 v74.84,68.95 | U21.140 v74.84,56.62 v74.84,56.63 | U21.152 74.81,60.22 v74.97,60.06 | v44.85,31.1 43.51,31.1 U20.55 | U20.49 42.21,29.33 41.95,29.07 v41.95,28.44 41.95,27.8 42.22,27.53 U20.43 | U21.104 75.44,45.82 v75.48,45.78 | U21.110 v74.84,47.62 | v74.84,47.62 v74.84,47.61 | U21.116 74.69,49.42 74.84,49.26 74.84,47.63 v74.84,47.62 | U21.122 74.77,51.22 v74.84,51.3 | U21.146 74.73,58.42 v74.97,58.66 | U20.37 41.87,22.13 v41.57,21.83 | U20.31 42.1,20.33 v41.57,19.8 | U20.25 v45,18.53 | U20.19 41.8,16.73 v41.7,16.62 | U20.13 41.87,14.93 v41.69,15.11 | U20.7 42.39,13.13 v41.95,12.69 | U20.1 43.45,11.29 v41.95,11.29 | U21.26 74.63,18.82 75.45,19.64 75.45,20.62